# Altium project BE-PC_EXP_V100.PrjPcb (part 2 of 4)

## Sheet 08_MCU.SchDoc
size 420 x 297 mm; SheetNumber: 15; SheetTotal: 29
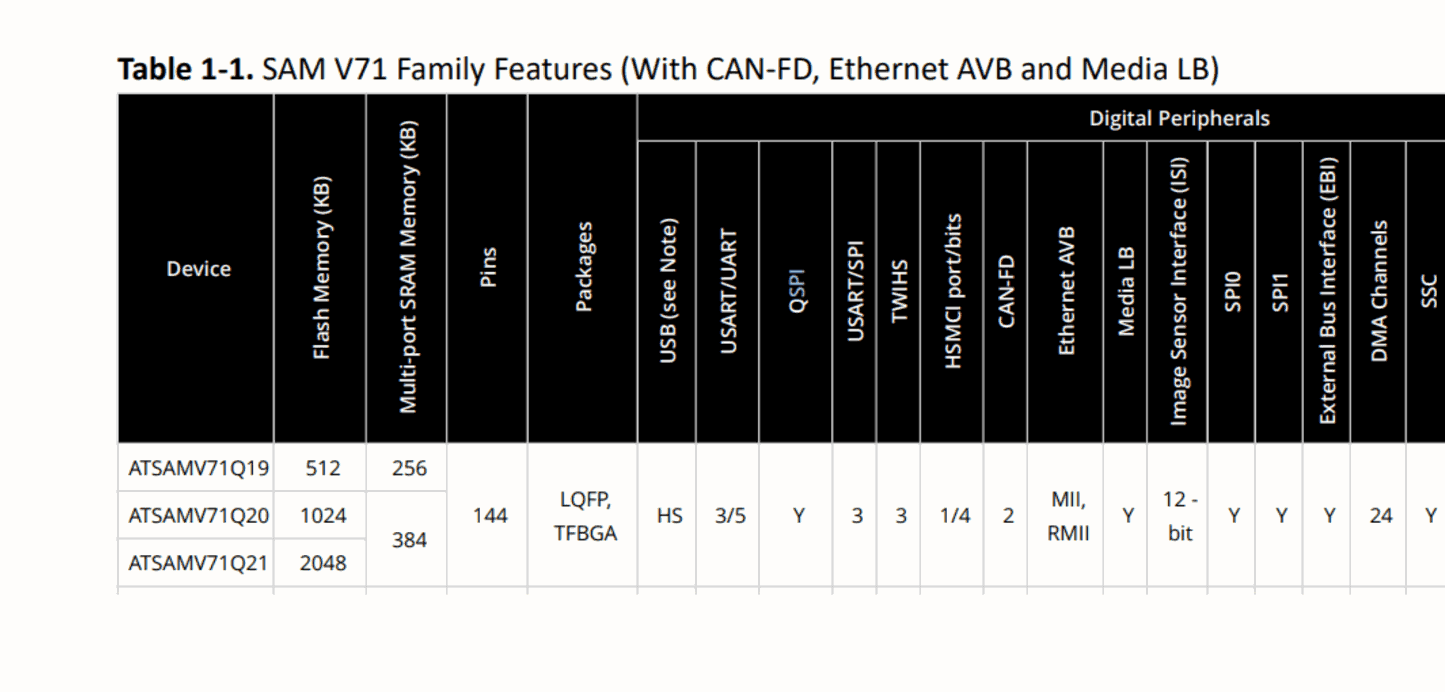
[diagram p13: 08_MCU.SchDoc, top left]
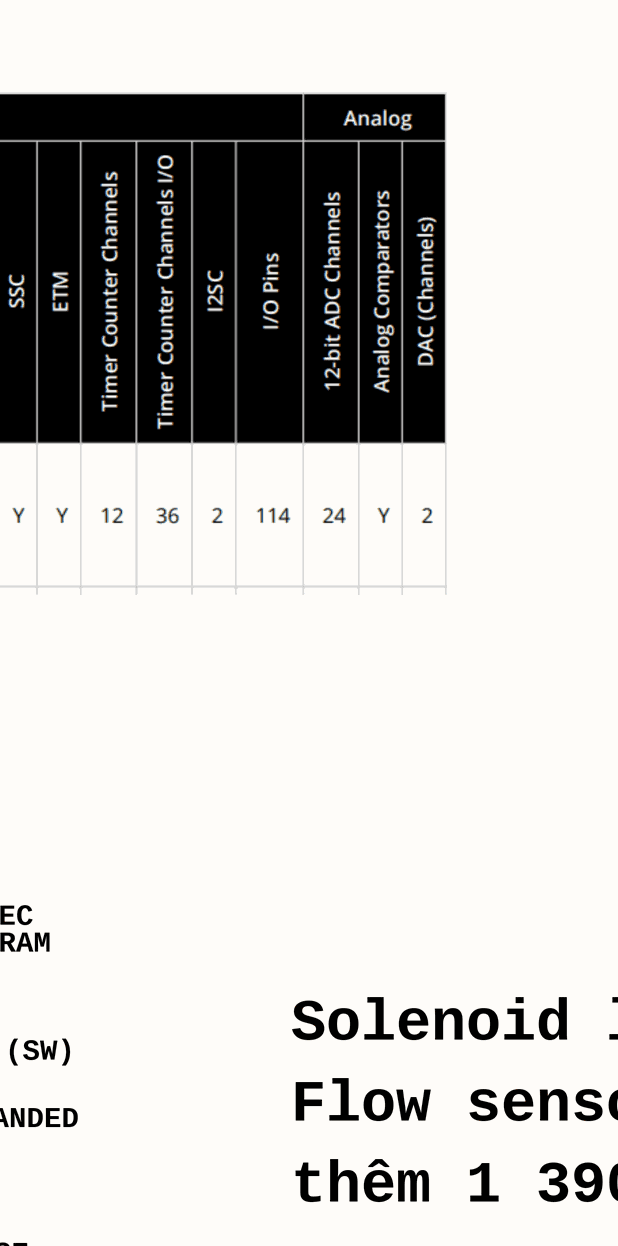
[diagram p14: 08_MCU.SchDoc, top right]
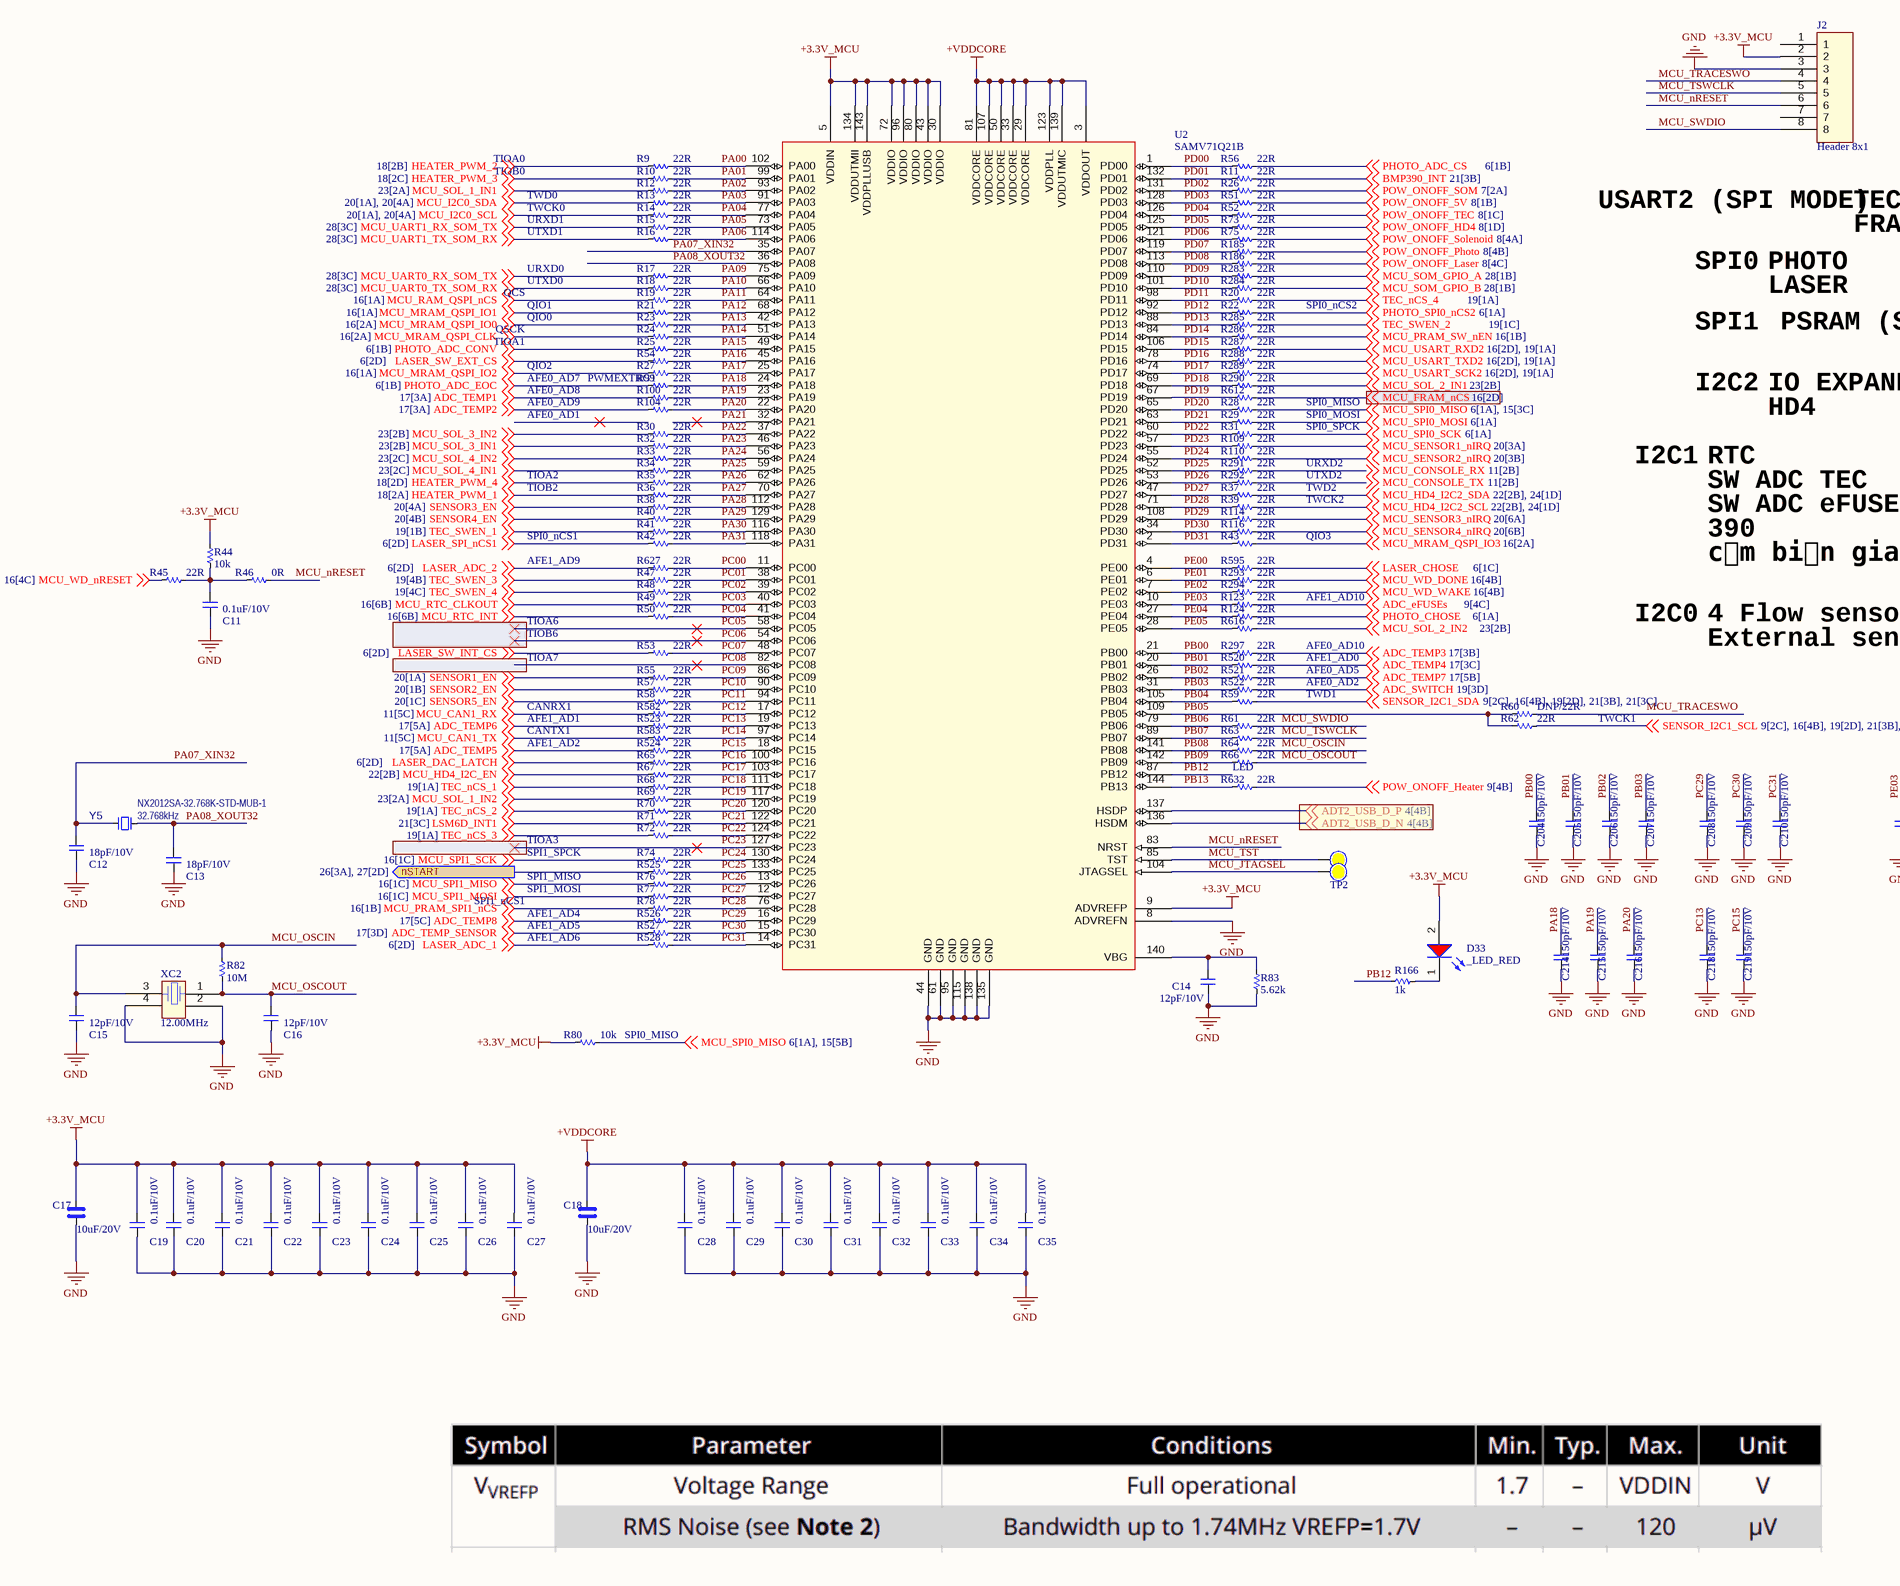
[diagram p15: 08_MCU.SchDoc, bottom left]
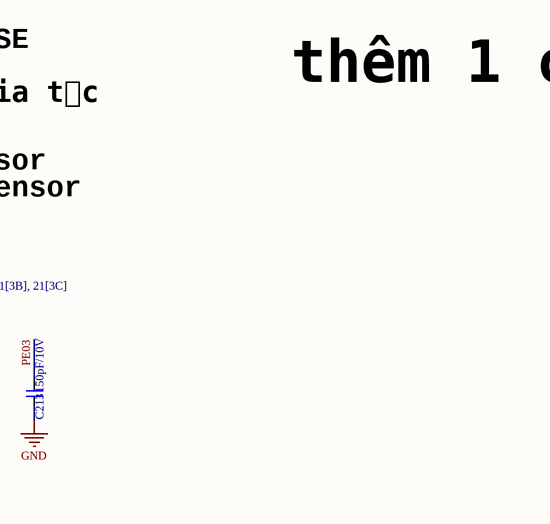
[diagram p16: 08_MCU.SchDoc, bottom right]

### Parts
C11  0.1uF/10V  [CAP_C_1005X60]
C12  18pF/10V  [CAP_C_1005X60]
C13  18pF/10V  [CAP_C_1005X60]
C14  12pF/10V  [CAP_C_1005X60]
C15  12pF/10V  [CAP_C_1005X60]
C16  12pF/10V  [CAP_C_1005X60]
C17  10uF/20V  [CAP_C_2012X110]
C18  10uF/20V  [CAP_C_2012X110]
C19  0.1uF/10V  [CAP_C_1005X60]
C20  0.1uF/10V  [CAP_C_1005X60]
C21  0.1uF/10V  [CAP_C_1005X60]
C22  0.1uF/10V  [CAP_C_1005X60]
C23  0.1uF/10V  [CAP_C_1005X60]
C24  0.1uF/10V  [CAP_C_1005X60]
C25  0.1uF/10V  [CAP_C_1005X60]
C26  0.1uF/10V  [CAP_C_1005X60]
C27  0.1uF/10V  [CAP_C_1005X60]
C28  0.1uF/10V  [CAP_C_1005X60]
C29  0.1uF/10V  [CAP_C_1005X60]
C30  0.1uF/10V  [CAP_C_1005X60]
C31  0.1uF/10V  [CAP_C_1005X60]
C32  0.1uF/10V  [CAP_C_1005X60]
C33  0.1uF/10V  [CAP_C_1005X60]
C34  0.1uF/10V  [CAP_C_1005X60]
C35  0.1uF/10V  [CAP_C_1005X60]
C204  150pF/10V  [CAP_C_1005X60]
C205  150pF/10V  [CAP_C_1005X60]
C206  150pF/10V  [CAP_C_1005X60]
C207  150pF/10V  [CAP_C_1005X60]
C208  150pF/10V  [CAP_C_1005X60]
C209  150pF/10V  [CAP_C_1005X60]
C210  150pF/10V  [CAP_C_1005X60]
C213  150pF/10V  [CAP_C_1005X60]
C214  150pF/10V  [CAP_C_1005X60]
C215  150pF/10V  [CAP_C_1005X60]
C216  150pF/10V  [CAP_C_1005X60]
C218  150pF/10V  [CAP_C_1005X60]
C219  150pF/10V  [CAP_C_1005X60]
D33  _LED_RED  [LED_0603]
J2  Header 8x1  [Header_254P_8x1]
R9  22R  [RES_C_1005X40]
R10  22R  [RES_C_1005X40]
R11  22R  [RES_C_1005X40]
R12  22R  [RES_C_1005X40]
R13  22R  [RES_C_1005X40]
R14  22R  [RES_C_1005X40]
R15  22R  [RES_C_1005X40]
R16  22R  [RES_C_1005X40]
R17  22R  [RES_C_1005X40]
R18  22R  [RES_C_1005X40]
R19  22R  [RES_C_1005X40]
R20  22R  [RES_C_1005X40]
R21  22R  [RES_C_1005X40]
R22  22R  [RES_C_1005X40]
R23  22R  [RES_C_1005X40]
R24  22R  [RES_C_1005X40]
R25  22R  [RES_C_1005X40]
R26  22R  [RES_C_1005X40]
R27  22R  [RES_C_1005X40]
R28  22R  [RES_C_1005X40]
R29  22R  [RES_C_1005X40]
R30  22R  [RES_C_1005X40]
R31  22R  [RES_C_1005X40]
R32  22R  [RES_C_1005X40]
R33  22R  [RES_C_1005X40]
R34  22R  [RES_C_1005X40]
R35  22R  [RES_C_1005X40]
R36  22R  [RES_C_1005X40]
R37  22R  [RES_C_1005X40]
R38  22R  [RES_C_1005X40]
R39  22R  [RES_C_1005X40]
R40  22R  [RES_C_1005X40]
R41  22R  [RES_C_1005X40]
R42  22R  [RES_C_1005X40]
R43  22R  [RES_C_1005X40]
R44  10k  [RES_C_1005X40]
R45  22R  [RES_C_1005X40]
R46  0R  [RES_C_1005X40]
R47  22R  [RES_C_1005X40]
R48  22R  [RES_C_1005X40]
R49  22R  [RES_C_1005X40]
R50  22R  [RES_C_1005X40]
R51  22R  [RES_C_1005X40]
R52  22R  [RES_C_1005X40]
R53  22R  [RES_C_1005X40]
R54  22R  [RES_C_1005X40]
R55  22R  [RES_C_1005X40]
R56  22R  [RES_C_1005X40]
R57  22R  [RES_C_1005X40]
R58  22R  [RES_C_1005X40]
R59  22R  [RES_C_1005X40]
R60  DNP/22R  [RES_C_1005X40]
R61  22R  [RES_C_1005X40]
R62  22R  [RES_C_1005X40]
R63  22R  [RES_C_1005X40]
R64  22R  [RES_C_1005X40]
R65  22R  [RES_C_1005X40]
R66  22R  [RES_C_1005X40]
R67  22R  [RES_C_1005X40]
R68  22R  [RES_C_1005X40]
R69  22R  [RES_C_1005X40]
R70  22R  [RES_C_1005X40]
R71  22R  [RES_C_1005X40]
R72  22R  [RES_C_1005X40]
R73  22R  [RES_C_1005X40]
R74  22R  [RES_C_1005X40]
R75  22R  [RES_C_1005X40]
R76  22R  [RES_C_1005X40]
R77  22R  [RES_C_1005X40]
R78  22R  [RES_C_1005X40]
R80  10k  [RES_C_1005X40]
R82  10M  [RES_C_1005X40]
R83  5.62k  [RES_C_1005X40]
R99  22R  [RES_C_1005X40]
R100  22R  [RES_C_1005X40]
R104  22R  [RES_C_1005X40]
R109  22R  [RES_C_1005X40]
R110  22R  [RES_C_1005X40]
R114  22R  [RES_C_1005X40]
R116  22R  [RES_C_1005X40]
R123  22R  [RES_C_1005X40]
R124  22R  [RES_C_1005X40]
R166  1k  [RES_C_1005X40]
R185  22R  [RES_C_1005X40]
R186  22R  [RES_C_1005X40]
R283  22R  [RES_C_1005X40]
R284  22R  [RES_C_1005X40]
R285  22R  [RES_C_1005X40]
R286  22R  [RES_C_1005X40]
R287  22R  [RES_C_1005X40]
R288  22R  [RES_C_1005X40]
R289  22R  [RES_C_1005X40]
R290  22R  [RES_C_1005X40]
R291  22R  [RES_C_1005X40]
R292  22R  [RES_C_1005X40]
R293  22R  [RES_C_1005X40]
R294  22R  [RES_C_1005X40]
R297  22R  [RES_C_1005X40]
R520  22R  [RES_C_1005X40]
R521  22R  [RES_C_1005X40]
R522  22R  [RES_C_1005X40]
R523  22R  [RES_C_1005X40]
R524  22R  [RES_C_1005X40]
R525  22R  [RES_C_1005X40]
R526  22R  [RES_C_1005X40]
R527  22R  [RES_C_1005X40]
R528  22R  [RES_C_1005X40]
R582  22R  [RES_C_1005X40]
R583  22R  [RES_C_1005X40]
R595  22R  [RES_C_1005X40]
R612  22R  [RES_C_1005X40]
R616  22R  [RES_C_1005X40]
R627  22R  [RES_C_1005X40]
R632  22R  [RES_C_1005X40]
TP1  (no value)  [Testpoint_TH_D130H80]  (no BOM)
TP2  (no value)  [Testpoint_TH_D130H80]  (no BOM)
U2  SAMV71Q21B  [AP6-00118]
XC2  value 12.00MHz  [AP7-00039]
Y5  value 32.768kHz  Manufacturer Part Number 1: NX2012SA-32.768K-STD-MUB-1  [CRYSTAL_NX2012SA]  (hidden comment: Crystal 2 Pins)

### Ports
nSTART (out, see 26[3A], 27[2D])

### Nets
+3.3V_MCU: C17.1 C19.2 C20.2 C21.2 C22.2 C23.2 C24.2 C25.2 C26.2 C27.2 D33.2(A) J2.2 R44.2 R80.2 U2.5(VDDIN) U2.9(ADVREFP) U2.30(VDDIO) U2.43(VDDIO) U2.72(VDDIO) U2.80(VDDIO) U2.96(VDDIO) U2.134(VDDUTMII) U2.143(VDDPLLUSB)
+VDDCORE: C18.1 C28.2 C29.2 C30.2 C31.2 C32.2 C33.2 C34.2 C35.2 U2.3(VDDOUT) U2.29(VDDCORE) U2.33(VDDCORE) U2.50(VDDCORE) U2.81(VDDCORE) U2.107(VDDCORE) U2.123(VDDPLL) U2.139(VDDUTMIC)
GND: C11.1 C12.1 C13.1 C14.1 C15.1 C16.1 C17.2 C18.2 C19.1 C20.1 C21.1 C22.1 C23.1 C24.1 C25.1 C26.1 C27.1 C28.1 C29.1 C30.1 C31.1 C32.1 C33.1 C34.1 C35.1 C204.1 C205.1 C206.1 C207.1 C208.1 C209.1 C210.1 C213.1 C214.1 C215.1 C216.1 C218.1 C219.1 J2.3 R83.1 U2.8(ADVREFN) U2.44(GND) U2.61(GND) U2.95(GND) U2.115(GND) U2.135(GND) U2.138(GND) XC2.2 XC2.4
ADC_eFUSEs: R123.1 ; off-sheet ADC_eFUSEs
ADC_SWITCH: R522.1 ; off-sheet ADC_SWITCH
ADC_TEMP1: R100.2 ; off-sheet ADC_TEMP1
ADC_TEMP2: R104.2 ; off-sheet ADC_TEMP2
ADC_TEMP3: R297.1 ; off-sheet ADC_TEMP3
ADC_TEMP4: R520.1 ; off-sheet ADC_TEMP4
ADC_TEMP5: R524.2 ; off-sheet ADC_TEMP5
ADC_TEMP6: R523.2 ; off-sheet ADC_TEMP6
ADC_TEMP7: R521.1 ; off-sheet ADC_TEMP7
ADC_TEMP8: R526.2 ; off-sheet ADC_TEMP8
ADC_TEMP_SENSOR: R527.2 ; off-sheet ADC_TEMP_SENSOR  [project net TEMP _SENSOR]
ADT2_USB_D_N: U2.136(HSDM) ; off-sheet ADT2_USB_D_N
ADT2_USB_D_P: U2.137(HSDP) ; off-sheet ADT2_USB_D_P
BMP390_INT: R11.1 ; off-sheet BMP390_INT
HEATER_PWM_1: R36.2 ; off-sheet HEATER_PWM_1
HEATER_PWM_2: R9.2 ; off-sheet HEATER_PWM_2
HEATER_PWM_3: R10.2 ; off-sheet HEATER_PWM_3
HEATER_PWM_4: R35.2 ; off-sheet HEATER_PWM_4
LASER_ADC_1: R528.2 ; off-sheet LASER_ADC_1
LASER_ADC_2: R627.2 ; off-sheet LASER_ADC_2
LASER_CHOSE: R595.1 ; off-sheet LASER_CHOSE
LASER_DAC_LATCH: R65.2 ; off-sheet LASER_DAC_LATCH
LASER_SPI_nCS1: R42.2 ; off-sheet LASER_SPI_nCS1
LASER_SW_EXT_CS: R54.2 ; off-sheet LASER_SW_EXT_CS
LASER_SW_INT_CS: R53.2 ; off-sheet LASER_SW_INT_CS
LSM6D_INT1: R71.2 ; off-sheet LSM6D_INT1
MCU_CAN1_RX: R582.2 ; off-sheet MCU_CAN1_RX
MCU_CAN1_TX: R583.2 ; off-sheet MCU_CAN1_TX
MCU_CONSOLE_RX: R291.1 ; off-sheet MCU_CONSOLE_RX
MCU_CONSOLE_TX: R292.1 ; off-sheet MCU_CONSOLE_TX
MCU_FRAM_nCS: R612.1 ; off-sheet MCU_FRAM_nCS
MCU_HD4_I2C2_SCL: R39.1 ; off-sheet MCU_HD4_I2C2_SCL
MCU_HD4_I2C2_SDA: R37.1 ; off-sheet MCU_HD4_I2C2_SDA
MCU_HD4_I2C_EN: R67.2 ; off-sheet MCU_HD4_I2C_EN
MCU_I2C0_SCL: R14.2 ; off-sheet MCU_I2C0_SCL
MCU_I2C0_SDA: R13.2 ; off-sheet MCU_I2C0_SDA
MCU_JTAGSEL: TP2.1 U2.104(JTAGSEL)
MCU_MRAM_QSPI_CLK: R24.2 ; off-sheet MCU_MRAM_QSPI_CLK
MCU_MRAM_QSPI_IO0: R23.2 ; off-sheet MCU_MRAM_QSPI_IO0
MCU_MRAM_QSPI_IO1: R21.2 ; off-sheet MCU_MRAM_QSPI_IO1
MCU_MRAM_QSPI_IO2: R27.2 ; off-sheet MCU_MRAM_QSPI_IO2
MCU_MRAM_QSPI_IO3: R43.1 ; off-sheet MCU_MRAM_QSPI_IO3
MCU_nRESET: J2.6 R46.1 U2.83(NRST)
MCU_OSCIN: C15.2 R64.1 R82.2 XC2.3
MCU_OSCOUT: C16.2 R66.1 R82.1 XC2.1
MCU_PRAM_SPI1_nCS: R78.2 ; off-sheet MCU_PRAM_SPI1_nCS
MCU_PRAM_SW_nEN: R286.1 ; off-sheet MCU_PRAM_SW_nEN
MCU_RAM_QSPI_nCS: R19.2 ; off-sheet MCU_RAM_QSPI_nCS
MCU_RTC_CLKOUT: R49.2 ; off-sheet MCU_RTC_CLKOUT
MCU_RTC_INT: R50.2 ; off-sheet MCU_RTC_INT
MCU_SENSOR1_nIRQ: R109.1 ; off-sheet MCU_SENSOR1_nIRQ
MCU_SENSOR2_nIRQ: R110.1 ; off-sheet MCU_SENSOR2_nIRQ
MCU_SENSOR3_nIRQ: R114.1 ; off-sheet MCU_SENSOR3_nIRQ
MCU_SENSOR4_nIRQ: R116.1 ; off-sheet MCU_SENSOR4_nIRQ
MCU_SOL_1_IN1: R12.2 ; off-sheet MCU_SOL_1_IN1
MCU_SOL_1_IN2: R69.2 ; off-sheet MCU_SOL_1_IN2
MCU_SOL_2_IN1: R290.1 ; off-sheet MCU_SOL_2_IN1
MCU_SOL_2_IN2: R616.1 ; off-sheet MCU_SOL_2_IN2
MCU_SOL_3_IN1: R32.2 ; off-sheet MCU_SOL_3_IN1
MCU_SOL_3_IN2: R30.2 ; off-sheet MCU_SOL_3_IN2
MCU_SOL_4_IN1: R34.2 ; off-sheet MCU_SOL_4_IN1
MCU_SOL_4_IN2: R33.2 ; off-sheet MCU_SOL_4_IN2
MCU_SOM_GPIO_A: R283.1 ; off-sheet MCU_SOM_GPIO_A
MCU_SOM_GPIO_B: R284.1 ; off-sheet MCU_SOM_GPIO_B
MCU_SPI0_MISO: R28.1 R80.1 ; off-sheet MCU_SPI0_MISO
MCU_SPI0_MOSI: R29.1 ; off-sheet MCU_SPI0_MOSI
MCU_SPI0_SCK: R31.1 ; off-sheet MCU_SPI0_SCK
MCU_SPI1_MISO: R76.2 ; off-sheet MCU_SPI1_MISO
MCU_SPI1_MOSI: R77.2 ; off-sheet MCU_SPI1_MOSI
MCU_SPI1_SCK: R74.2 ; off-sheet MCU_SPI1_SCK
MCU_SWDIO: J2.8 R61.1
MCU_TRACESWO: J2.4 R60.1
MCU_TST: TP1.1 U2.85(TST)
MCU_TSWCLK: J2.5 R63.1
MCU_UART0_RX_SOM_TX: R17.2 ; off-sheet MCU_UART0_RX_SOM_TX
MCU_UART0_TX_SOM_RX: R18.2 ; off-sheet MCU_UART0_TX_SOM_RX
MCU_UART1_RX_SOM_TX: R15.2 ; off-sheet MCU_UART1_RX_SOM_TX
MCU_UART1_TX_SOM_RX: R16.2 ; off-sheet MCU_UART1_TX_SOM_RX
MCU_USART_RXD2: R287.1 ; off-sheet MCU_USART_RXD2
MCU_USART_SCK2: R289.1 ; off-sheet MCU_USART_SCK2
MCU_USART_TXD2: R288.1 ; off-sheet MCU_USART_TXD2
MCU_WD_DONE: R293.1 ; off-sheet MCU_WD_DONE  [project net WD_DONE]
MCU_WD_nRESET: R45.2 ; off-sheet MCU_WD_nRESET  [project net WD_nRESET]
MCU_WD_WAKE: R294.1 ; off-sheet MCU_WD_WAKE  [project net WD_WAKE]
PA00: R9.1 U2.102(PA00)
PA01: R10.1 U2.99(PA01)
PA02: R12.1 U2.93(PA02)
PA03: R13.1 U2.91(PA03)
PA04: R14.1 U2.77(PA04)
PA05: R15.1 U2.73(PA05)
PA06: R16.1 U2.114(PA06)
PA07_XIN32: C12.2 U2.35(PA07) Y5.2(Osc2)
PA08_XOUT32: C13.2 U2.36(PA08) Y5.1(Osc1)
PA09: R17.1 U2.75(PA09)
PA10: R18.1 U2.66(PA10)
PA11: R19.1 U2.64(PA11)
PA12: R21.1 U2.68(PA12)
PA13: R23.1 U2.42(PA13)
PA14: R24.1 U2.51(PA14)
PA15: R25.1 U2.49(PA15)
PA16: R54.1 U2.45(PA16)
PA17: R27.1 U2.25(PA17)
PA18: C214.2 R99.1 U2.24(PA18)
PA19: C215.2 R100.1 U2.23(PA19)
PA20: C216.2 R104.1 U2.22(PA20)
PA21: U2.32(PA21)
PA22: R30.1 U2.37(PA22)
PA23: R32.1 U2.46(PA23)
PA24: R33.1 U2.56(PA24)
PA25: R34.1 U2.59(PA25)
PA26: R35.1 U2.62(PA26)
PA27: R36.1 U2.70(PA27)
PA28: R38.1 U2.112(PA28)
PA29: R40.1 U2.129(PA29)
PA30: R41.1 U2.116(PA30)
PA31: R42.1 U2.118(PA31)
PB00: C204.2 R297.2 U2.21(PB00)
PB01: C205.2 R520.2 U2.20(PB01)
PB02: C206.2 R521.2 U2.26(PB02)
PB03: C207.2 R522.2 U2.31(PB03)
PB04: R59.2 U2.105(PB04)
PB05: R60.2 R62.2 U2.109(PB05)
PB06: R61.2 U2.79(PB06)
PB07: R63.2 U2.89(PB07)
PB08: R64.2 U2.141(PB08)
PB09: R66.2 U2.142(PB09)
PB12: R166.1 U2.87(PB12)
PB13: R632.2 U2.144(PB13)
PC00: R627.1 U2.11(PC00)
PC01: R47.1 U2.38(PC01)
PC02: R48.1 U2.39(PC02)
PC03: R49.1 U2.40(PC03)
PC04: R50.1 U2.41(PC04)
PC05: U2.58(PC05)
PC06: U2.54(PC06)
PC07: R53.1 U2.48(PC07)
PC08: U2.82(PC08)
PC09: R55.1 U2.86(PC09)
PC10: R57.1 U2.90(PC10)
PC11: R58.1 U2.94(PC11)
PC12: R582.1 U2.17(PC12)
PC13: C218.2 R523.1 U2.19(PC13)
PC14: R583.1 U2.97(PC14)
PC15: C219.2 R524.1 U2.18(PC15)
PC16: R65.1 U2.100(PC16)
PC17: R67.1 U2.103(PC17)
PC18: R68.1 U2.111(PC18)
PC19: R69.1 U2.117(PC19)
PC20: R70.1 U2.120(PC20)
PC21: R71.1 U2.122(PC21)
PC22: R72.1 U2.124(PC22)
PC23: U2.127(PC23)
PC24: R74.1 U2.130(PC24)
PC25: R525.1 U2.133(PC25)
PC26: R76.1 U2.13(PC26)
PC27: R77.1 U2.12(PC27)
PC28: R78.1 U2.76(PC28)
PC29: C208.2 R526.1 U2.16(PC29)
PC30: C209.2 R527.1 U2.15(PC30)
PC31: C210.2 R528.1 U2.14(PC31)
PD00: R56.2 U2.1(PD00)
PD01: R11.2 U2.132(PD01)
PD02: R26.2 U2.131(PD02)
PD03: R51.2 U2.128(PD03)
PD04: R52.2 U2.126(PD04)
PD05: R73.2 U2.125(PD05)
PD06: R75.2 U2.121(PD06)
PD07: R185.2 U2.119(PD07)
PD08: R186.2 U2.113(PD08)
PD09: R283.2 U2.110(PD09)
PD10: R284.2 U2.101(PD10)
PD11: R20.2 U2.98(PD11)
PD12: R22.2 U2.92(PD12)
PD13: R285.2 U2.88(PD13)
PD14: R286.2 U2.84(PD14)
PD15: R287.2 U2.106(PD15)
PD16: R288.2 U2.78(PD16)
PD17: R289.2 U2.74(PD17)
PD18: R290.2 U2.69(PD18)
PD19: R612.2 U2.67(PD19)
PD20: R28.2 U2.65(PD20)
PD21: R29.2 U2.63(PD21)
PD22: R31.2 U2.60(PD22)
PD23: R109.2 U2.57(PD23)
PD24: R110.2 U2.55(PD24)
PD25: R291.2 U2.52(PD25)
PD26: R292.2 U2.53(PD26)
PD27: R37.2 U2.47(PD27)
PD28: R39.2 U2.71(PD28)
PD29: R114.2 U2.108(PD29)
PD30: R116.2 U2.34(PD30)
PD31: R43.2 U2.2(PD31)
PE00: R595.2 U2.4(PE00)
PE01: R293.2 U2.6(PE01)
PE02: R294.2 U2.7(PE02)
PE03: C213.2 R123.2 U2.10(PE03)
PE04: R124.2 U2.27(PE04)
PE05: R616.2 U2.28(PE05)
PHOTO_ADC_CONV: R25.2 ; off-sheet PHOTO_ADC_CONV
PHOTO_ADC_CS: R56.1 ; off-sheet PHOTO_ADC_CS
PHOTO_ADC_EOC: R99.2 ; off-sheet PHOTO_ADC_EOC
PHOTO_CHOSE: R124.1 ; off-sheet PHOTO_CHOSE
PHOTO_SPI0_nCS2: R22.1 ; off-sheet PHOTO_SPI0_nCS2
POW_ONOFF_5V: R51.1 ; off-sheet POW_ONOFF_5V
POW_ONOFF_HD4: R73.1 ; off-sheet POW_ONOFF_HD4
POW_ONOFF_Heater: R632.1 ; off-sheet POW_ONOFF_Heater
POW_ONOFF_Laser: R186.1 ; off-sheet POW_ONOFF_Laser
POW_ONOFF_Photo: R185.1 ; off-sheet POW_ONOFF_Photo
POW_ONOFF_Solenoid: R75.1 ; off-sheet POW_ONOFF_Solenoid
POW_ONOFF_SOM: R26.1 ; off-sheet POW_ONOFF_SOM
POW_ONOFF_TEC: R52.1 ; off-sheet POW_ONOFF_TEC
SENSOR1_EN: R55.2 ; off-sheet SENSOR1_EN
SENSOR2_EN: R57.2 ; off-sheet SENSOR2_EN
SENSOR3_EN: R38.2 ; off-sheet SENSOR3_EN
SENSOR4_EN: R40.2 ; off-sheet SENSOR4_EN
SENSOR5_EN: R58.2 ; off-sheet SENSOR5_EN
SENSOR_I2C1_SCL: R62.1 ; off-sheet SENSOR_I2C1_SCL
SENSOR_I2C1_SDA: R59.1 ; off-sheet SENSOR_I2C1_SDA
TEC_nCS_1: R68.2 ; off-sheet TEC_nCS_1
TEC_nCS_2: R70.2 ; off-sheet TEC_nCS_2
TEC_nCS_3: R72.2 ; off-sheet TEC_nCS_3
TEC_nCS_4: R20.1 ; off-sheet TEC_nCS_4
TEC_SWEN_1: R41.2 ; off-sheet TEC_SWEN_1
TEC_SWEN_2: R285.1 ; off-sheet TEC_SWEN_2
TEC_SWEN_3: R47.2 ; off-sheet TEC_SWEN_3
TEC_SWEN_4: R48.2 ; off-sheet TEC_SWEN_4
NetC11_2: C11.2 R44.1 R45.1 R46.2
NetC14_2: C14.2 R83.2 U2.140(VBG)
NetC288_1: R525.2 ; port nSTART
NetD33_1: D33.1(K) R166.2

Not connected (* = marked no-connect by the designer): J2 1 7

### Notes on the sheet
- TWD0
- TWCK0
- TIOA0
- TIOB0
- USART2 (SPI MODE)
- TEC
- URXD1
- UTXD1
- URXD0
- SPI0
- PHOTO
- FRAM
- UTXD0
- QIO1
- QCS
- QSCK
- QIO0
- SPI0_nCS2
- SPI1
- LASER
- PSRAM (SW)
- Solenoid lên 16 cái
- QIO2
- AFE0_AD8
- AFE0_AD7
- TIOA1
- PWMEXTRG1
- I2C2
- IO EXPANDED
- Flow sensor thêm 2 cái
- AFE0_AD1
- AFE0_AD9
- SPI0_MISO
- SPI0_MOSI
- SPI0_SPCK
- HD4
- TIOA2
- TIOB2
- TWD2
- TWCK2
- URXD2
- UTXD2
- I2C1
- RTC
- SW ADC TEC
- SW ADC eFUSE
- thêm 1 390 onboard
- SPI0_nCS1
- AFE1_AD9
- QIO3
- 390
- cảm biến gia tốc
- thêm 1 con cbien gia tốc
- TIOA6
- TIOB6
- AFE1_AD10
- I2C0
- 4 Flow sensor
- TIOA7
- AFE0_AD2
- AFE0_AD10
- AFE0_AD5
- AFE1_AD0
- TWD1
- External sensor
- AFE1_AD2
- AFE1_AD1
- CANRX1
- CANTX1
- TWCK1
- (near R66) LED
- SPI1_MISO
- SPI1_SPCK
- TIOA3
- SPI1_nCS1
- SPI1_MOSI
- AFE1_AD4
- AFE1_AD5
- AFE1_AD6
- (near R80) SPI0_MISO
- Project:
- Sub-system:
- Design by:
- Sheet title:
- Sheet
- of
- Checked by:
- Approved by:
- Revision:
- Document No:
- Size:
- Date:
- A3

### Library data of the parts
C11-C16 C19-C35 C204-C210 C213-C216 C218 C219 = _CAP_C_2: CAP CHIP
C17 C18 = _CAP_C_High_2: CAP CHIP High Value
R9-R78 R80 R82 R83 R99 R100 R104 R109 R110 R114 R116 R123 R124 R166 R185 R186 R283-R294 R297 R520-R528 R582 R583 R595 R612 R616 R627 R632 = _RES_B_2: RES
TP1 TP2 = Test Point: Solder: NF
U2 = A06-1541: SAM 32-bit ARM Cortex-M* RISC MCU, SAMV71B Series, QFP144; PartGroup: Integrated Circuits,MCU, MPU, DSP,ARM MCU; Manufacturer: MICROCHIP; MPN: ATSAMV71Q21B-AAB; TemperatureRange: -40Â°C to +105Â°C; AN: A06-1541; Value: SAMV71Q21B; Height: 1,60000002384186
XC2 = A07-0042: Fox FQ5032B 12.0MHz SMD crystal 738B-12; PartGroup: Frequency devices,Crystals,SMD; Manufacturer: Fox  Electronics; MPN: FQ5032B-12.000; Tolerance: Â±30ppm; TemperatureRange: 0Â°C ~ 70Â°C; AN: A07-0042; Height: 1,20000004768372
Y5 = OSC1092: Crystal; Manufacturer 1: NDK; Description_: CRYSTAL 32.768kHz 12.5pF SMD NX2012SA; Dev Tools Status: Production; Owner: Jamus Griego; Tolerance: ±20ppm; Load Capacitance: 12.5pF; Populated: YES; MCHP-ID: OSC1092; Revision: 1; Symbol: Crystal 2 Pins; Status: MCL Design; ComponentLink1URL: https://chn-vm-apps.microchip.com/mchprepo/parts/Datasheets/c_NX2012SA-STD-MUB-1_e.pdf; ComponentLink1Description: SVN Datasheet; ComponentLink2URL: C:\ALTIUM_WORK\00001_MCHP-CDB\Datasheets\c_NX2012SA-STD-MUB-1_e.pdf; ComponentLink2Description: Local Datasheet; ComponentLink3URL: C:\ALTIUM_WORK\00001_MCHP-CDB\Library\LibraryRefs\Crystal 2 Pins.SchLib; ComponentLink3Description: Open Symbol; ComponentLink4URL: C:\ALTIUM_WORK\00001_MCHP-CDB\Library\Footprints\CRYSTAL_NX2012SA.PcbLib; ComponentLink4Description: Open Footprint; ComponentLink5Description: Open Footprint 2; ComponentLink6Description: Open Footprint 3; ComponentLink7Description: Open Footprint 4; Type: Crystal; Category: Crystal/Oscillator; Supplier 1: Digi-Key; Supplier Part Number 1: 644-1219-1-ND; Quantity Override: 1

## Sheet 09_MRAM_RTC_WDT.SchDoc
size 420 x 297 mm; SheetNumber: 16; SheetTotal: 29
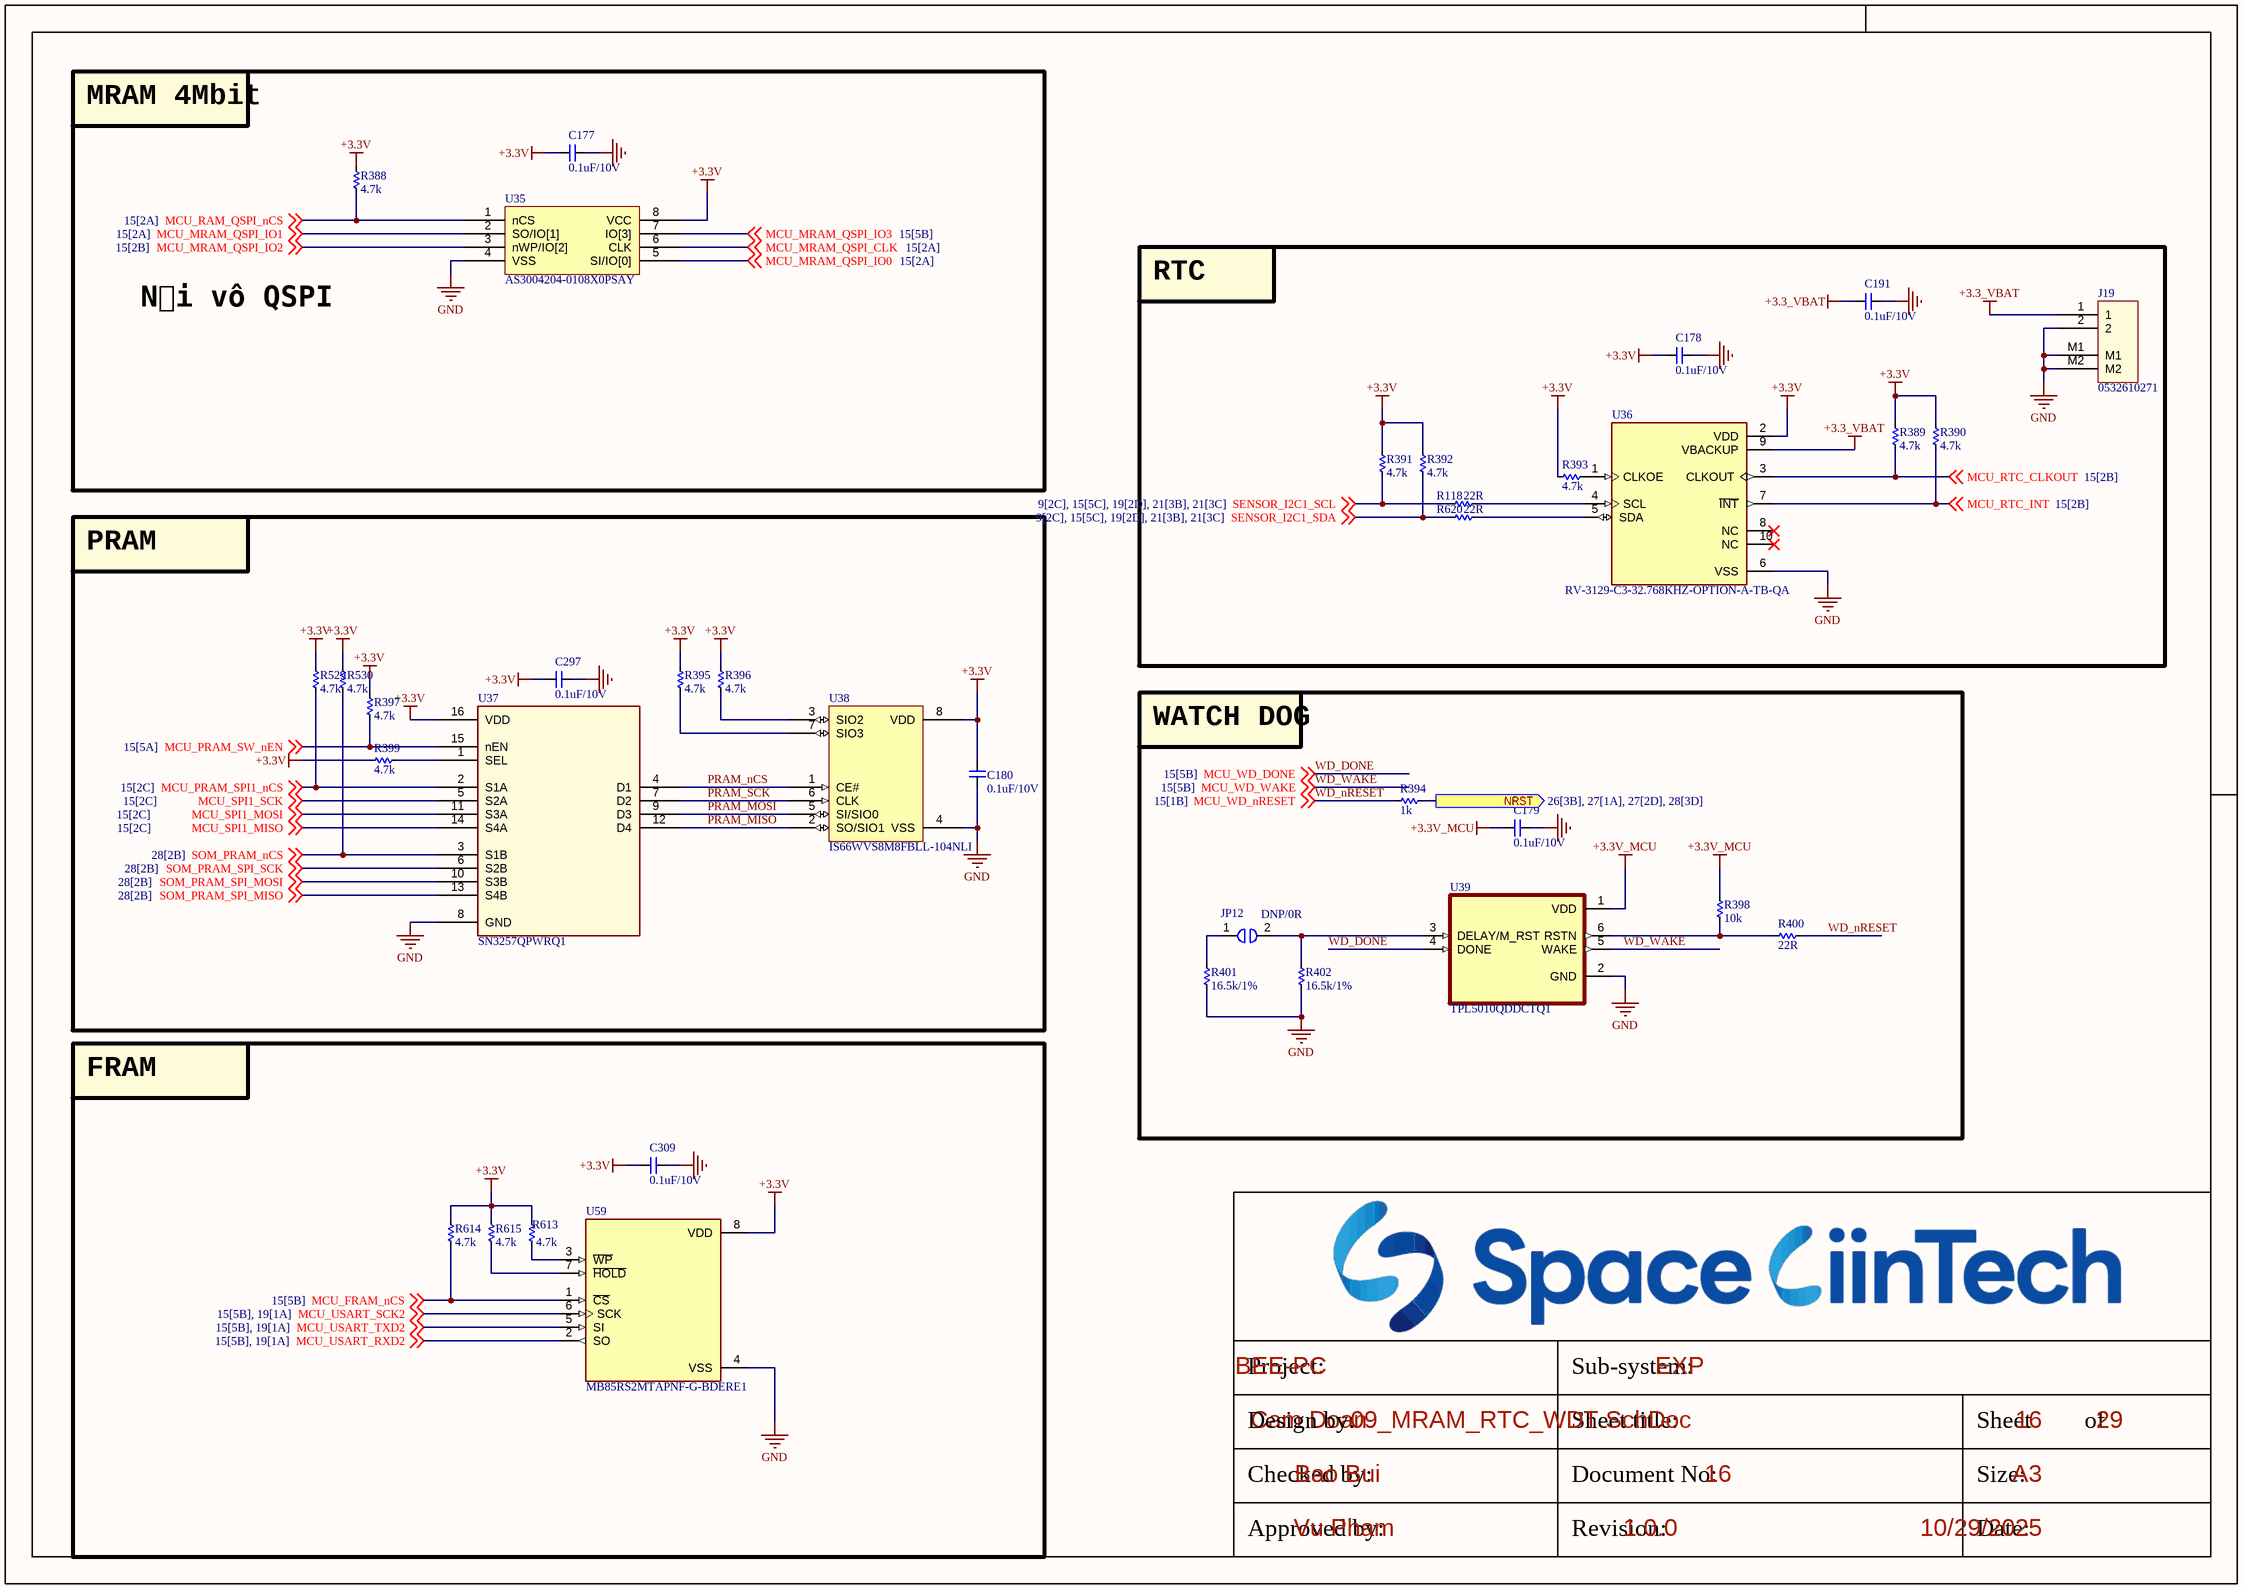
[diagram p17: 09_MRAM_RTC_WDT.SchDoc]

### Parts
C177  0.1uF/10V  [CAP_C_1005X60]
C178  0.1uF/10V  [CAP_C_1005X60]
C179  0.1uF/10V  [CAP_C_1005X60]
C180  0.1uF/10V  [CAP_C_1005X60]
C191  0.1uF/10V  [CAP_C_1005X60]
C297  0.1uF/10V  [CAP_C_1005X60]
C309  0.1uF/10V  [CAP_C_1005X60]
J19  0532610271  [MOLEX_0532610271]
JP12  DNP/0R  [RES_C_1608X60]
R118  22R  [RES_C_1005X40]
R388  4.7k  [RES_C_1005X40]
R389  4.7k  [RES_C_1005X40]
R390  4.7k  [RES_C_1005X40]
R391  4.7k  [RES_C_1005X40]
R392  4.7k  [RES_C_1005X40]
R393  4.7k  [RES_C_1005X40]
R394  1k  [RES_C_1005X40]
R395  4.7k  [RES_C_1005X40]
R396  4.7k  [RES_C_1005X40]
R397  4.7k  [RES_C_1005X40]
R398  10k  [RES_C_1005X40]
R399  4.7k  [RES_C_1005X40]
R400  22R  [RES_C_1005X40]
R401  16.5k/1%  [RES_C_1005X40]
R402  16.5k/1%  [RES_C_1005X40]
R529  4.7k  [RES_C_1005X40]
R530  4.7k  [RES_C_1005X40]
R613  4.7k  [RES_C_1005X40]
R614  4.7k  [RES_C_1005X40]
R615  4.7k  [RES_C_1005X40]
R620  22R  [RES_C_1005X40]
U35  AS3004204-0108X0PSAY  [SOIC127P790X216-8]
U36  RV-3129-C3-32.768KHZ-OPTION-A-TB-QA  [IC_RV-3129-C3_32.768KHZ_OPTION_A_TB_QA]
U37  SN3257QPWRQ1  [SOIC_PRQ1_TEX]
U38  IS66WVS8M8FBLL-104NLI  [SOIC8_150MIL_N_ISI]
U39  TPL5010QDDCTQ1  [SOT95P280X145-6N]
U59  MB85RS2MTAPNF-G-BDERE1  [SOIC127P602X173-8N]

### Blocks framed on the sheet
RTC: C178 C191 J19 R118 R389-R393 R620 U36
PRAM: C180 C297 R395-R397 R399 R529 R530 U37 U38
WATCH DOG: C179 JP12 R394 R398 R400-R402 U39
FRAM: C309 R613-R615 U59

### Ports
NRST (out, see 26[3B], 27[1A], 27[2D], 28[3D])

### Nets
+3.3_VBAT: C191.2 J19.1 U36.9(VBACKUP)
+3.3V: C177.2 C178.2 C180.1 C297.2 C309.2 R388.2 R389.2 R390.2 R391.2 R392.2 R393.2 R395.2 R396.2 R397.2 R399.2 R529.2 R530.2 R613.2 R614.2 R615.2 U35.8(VCC) U36.2(VDD) U37.16(VDD) U38.8(VDD) U59.8(VDD)
+3.3V_MCU: C179.2 R398.2 U39.1(VDD)
GND: C177.1 C178.1 C179.1 C180.2 C191.1 C297.1 C309.1 J19.2 J19.M1 J19.M2 R401.1 R402.1 U35.4(VSS) U36.6(VSS) U37.8(GND) U38.4(VSS) U39.2(GND) U59.4(VSS)
MCU_FRAM_nCS: R614.1 U59.1(~{CS}) ; off-sheet MCU_FRAM_nCS
MCU_MRAM_QSPI_CLK: U35.6(CLK) ; off-sheet MCU_MRAM_QSPI_CLK
MCU_MRAM_QSPI_IO0: U35.5(SI/IO[0]) ; off-sheet MCU_MRAM_QSPI_IO0
MCU_MRAM_QSPI_IO1: U35.2(SO/IO[1]) ; off-sheet MCU_MRAM_QSPI_IO1
MCU_MRAM_QSPI_IO2: U35.3(nWP/IO[2]) ; off-sheet MCU_MRAM_QSPI_IO2
MCU_MRAM_QSPI_IO3: U35.7(IO[3]) ; off-sheet MCU_MRAM_QSPI_IO3
MCU_PRAM_SPI1_nCS: R529.1 U37.2(S1A) ; off-sheet MCU_PRAM_SPI1_nCS
MCU_PRAM_SW_nEN: R397.1 U37.15(nEN) ; off-sheet MCU_PRAM_SW_nEN
MCU_RAM_QSPI_nCS: R388.1 U35.1(nCS) ; off-sheet MCU_RAM_QSPI_nCS
MCU_RTC_CLKOUT: R389.1 U36.3(CLKOUT) ; off-sheet MCU_RTC_CLKOUT
MCU_RTC_INT: R390.1 U36.7(~{INT}) ; off-sheet MCU_RTC_INT
MCU_SPI1_MISO: U37.14(S4A) ; off-sheet MCU_SPI1_MISO
MCU_SPI1_MOSI: U37.11(S3A) ; off-sheet MCU_SPI1_MOSI
MCU_SPI1_SCK: U37.5(S2A) ; off-sheet MCU_SPI1_SCK
MCU_USART_RXD2: U59.2(SO) ; off-sheet MCU_USART_RXD2
MCU_USART_SCK2: U59.6(SCK) ; off-sheet MCU_USART_SCK2
MCU_USART_TXD2: U59.5(SI) ; off-sheet MCU_USART_TXD2
PRAM_MISO: U37.12(D4) U38.2(SO/SIO1)
PRAM_MOSI: U37.9(D3) U38.5(SI/SIO0)
PRAM_nCS: U37.4(D1) U38.1(CE#)
PRAM_SCK: U37.7(D2) U38.6(CLK)
SENSOR_I2C1_SCL: R118.1 R391.1 ; off-sheet SENSOR_I2C1_SCL
SENSOR_I2C1_SDA: R392.1 R620.1 ; off-sheet SENSOR_I2C1_SDA
SOM_PRAM_nCS: R530.1 U37.3(S1B) ; off-sheet SOM_PRAM_nCS
SOM_PRAM_SPI_MISO: U37.13(S4B) ; off-sheet SOM_PRAM_SPI_MISO
SOM_PRAM_SPI_MOSI: U37.10(S3B) ; off-sheet SOM_PRAM_SPI_MOSI
SOM_PRAM_SPI_SCK: U37.6(S2B) ; off-sheet SOM_PRAM_SPI_SCK
WD_DONE: U39.4(DONE) ; off-sheet MCU_WD_DONE  [also labelled MCU_WD_DONE]
WD_nRESET: R394.2 R400.1 ; off-sheet MCU_WD_nRESET  [also labelled MCU_WD_nRESET]
WD_WAKE: U39.5(WAKE) ; off-sheet MCU_WD_WAKE  [also labelled MCU_WD_WAKE]
NetC290_2: R394.1 ; port NRST
NetJP12_1: JP12.1 R401.2
NetJP12_2: JP12.2 R402.2 U39.3(DELAY/M_RST)
NetR118_2: R118.2 U36.4(SCL)
NetR393_1: R393.1 U36.1(CLKOE)
NetR395_1: R395.1 U38.7(SIO3)
NetR396_1: R396.1 U38.3(SIO2)
NetR398_1: R398.1 R400.2 U39.6(RSTN)
NetR399_1: R399.1 U37.1(SEL)
NetR613_1: R613.1 U59.3(~{WP})
NetR615_1: R615.1 U59.7(~{HOLD})
NetR620_2: R620.2 U36.5(SDA)

Not connected (* = marked no-connect by the designer): U36 8(NC)* 10(NC)*

### Notes on the sheet
- MRAM 4Mbit
- Nối vô QSPI
- Project:
- Sub-system:
- Design by:
- Sheet title:
- Sheet
- of
- Checked by:
- Approved by:
- Revision:
- Document No:
- Size:
- Date:
- A3

### Library data of the parts
C177-C180 C191 C297 C309 = _CAP_C_2: CAP CHIP
J19 = Header 2x1_2M
JP12 = JUMPER_1_1
R118 R388-R402 R529 R530 R613-R615 R620 = _RES_B_2: RES
U35 = IC_RAM_AS3004204-0108X0PSAY
U36 = RV-3129-C3_32.768KHZ_OPTION_A_TB_QA: Real-Time Clock Module, Temperature compensated, in 2.5 x 3.7 mm package; MF: Micro Crystal; MP: RV-3129-C3 32.768KHZ OPTION A TB QA; SnapEDA_Link: https://www.snapeda.com/parts/RV-3129-C3%2032.768KHZ%20OPTION%20A%20TB%20QA/Micro+Crystal/view-part/?ref=snap; Package: QFN-10 Micro Crystal; Value: *; Check_prices: https://www.snapeda.com/parts/RV-3129-C3%2032.768KHZ%20OPTION%20A%20TB%20QA/Micro+Crystal/view-part/?ref=eda
U37 = IC_SW_SPI_SN3257QPWRQ1: Automotive 5-V, 2:1 (SPDT), 4-channel switch with 1.8-V logic and powered-off protection 16-TSSOP -40 to 125; Manufacturer_Name: Texas Instruments; Copyright: Copyright (C) 2025 Ultra Librarian. All rights reserved.; Manufacturer_Part_Number: SN3257QPWRQ1; Datasheet: https://www.ti.com/lit/gpn/sn3257-q1; RefDes: RefDes; Type: Type
U38 = IS66WVS4M8BLL-104NLI: No Description Available; Manufacturer_Name: ISSI; Type: Memory; Copyright: Copyright (C) 2025 Ultra Librarian. All rights reserved.; Manufacturer_Part_Number: IS66WVS4M8BLL-104NLI; RefDes: RefDes
U59 = MB85RS2MTAPNF-G-BDERE1: FRAM _Ferroelectric RAM_ Memory IC 2Mb _256K x 8_ SPI 40MHz 8-SOP; MF: Fujitsu Electronics; Package: SO-8 Fujitsu; Value: *; Digi-Key_Purchase_URL: https://www.digikey.com/product-detail/en/fujitsu-electronics-america-inc/MB85RS2MTAPNF-G-BDERE1/865-1286-1-ND/7916252?utm_source=snapeda&utm_medium=aggregator&utm_campaign=symbol; Digi-Key_Part_Number: 865-1286-1-ND; SnapEDA_Link: https://www.snapeda.com/parts/MB85RS2MTAPNF-G-BDERE1/Fujitsu%20Electronics%20America%2C%20Inc./view-part/2344795/?ref=snap; MP: MB85RS2MTAPNF-G-BDERE1
U39 = TPL5010QDDCTQ1: Package: None; Price: None; Value: *; MP: TPL5010QDDCTQ1; Availability: Unavailable

## Sheet 10_NTC_TEMPSENSOR.SchDoc
size 420 x 297 mm; SheetNumber: 17; SheetTotal: 28
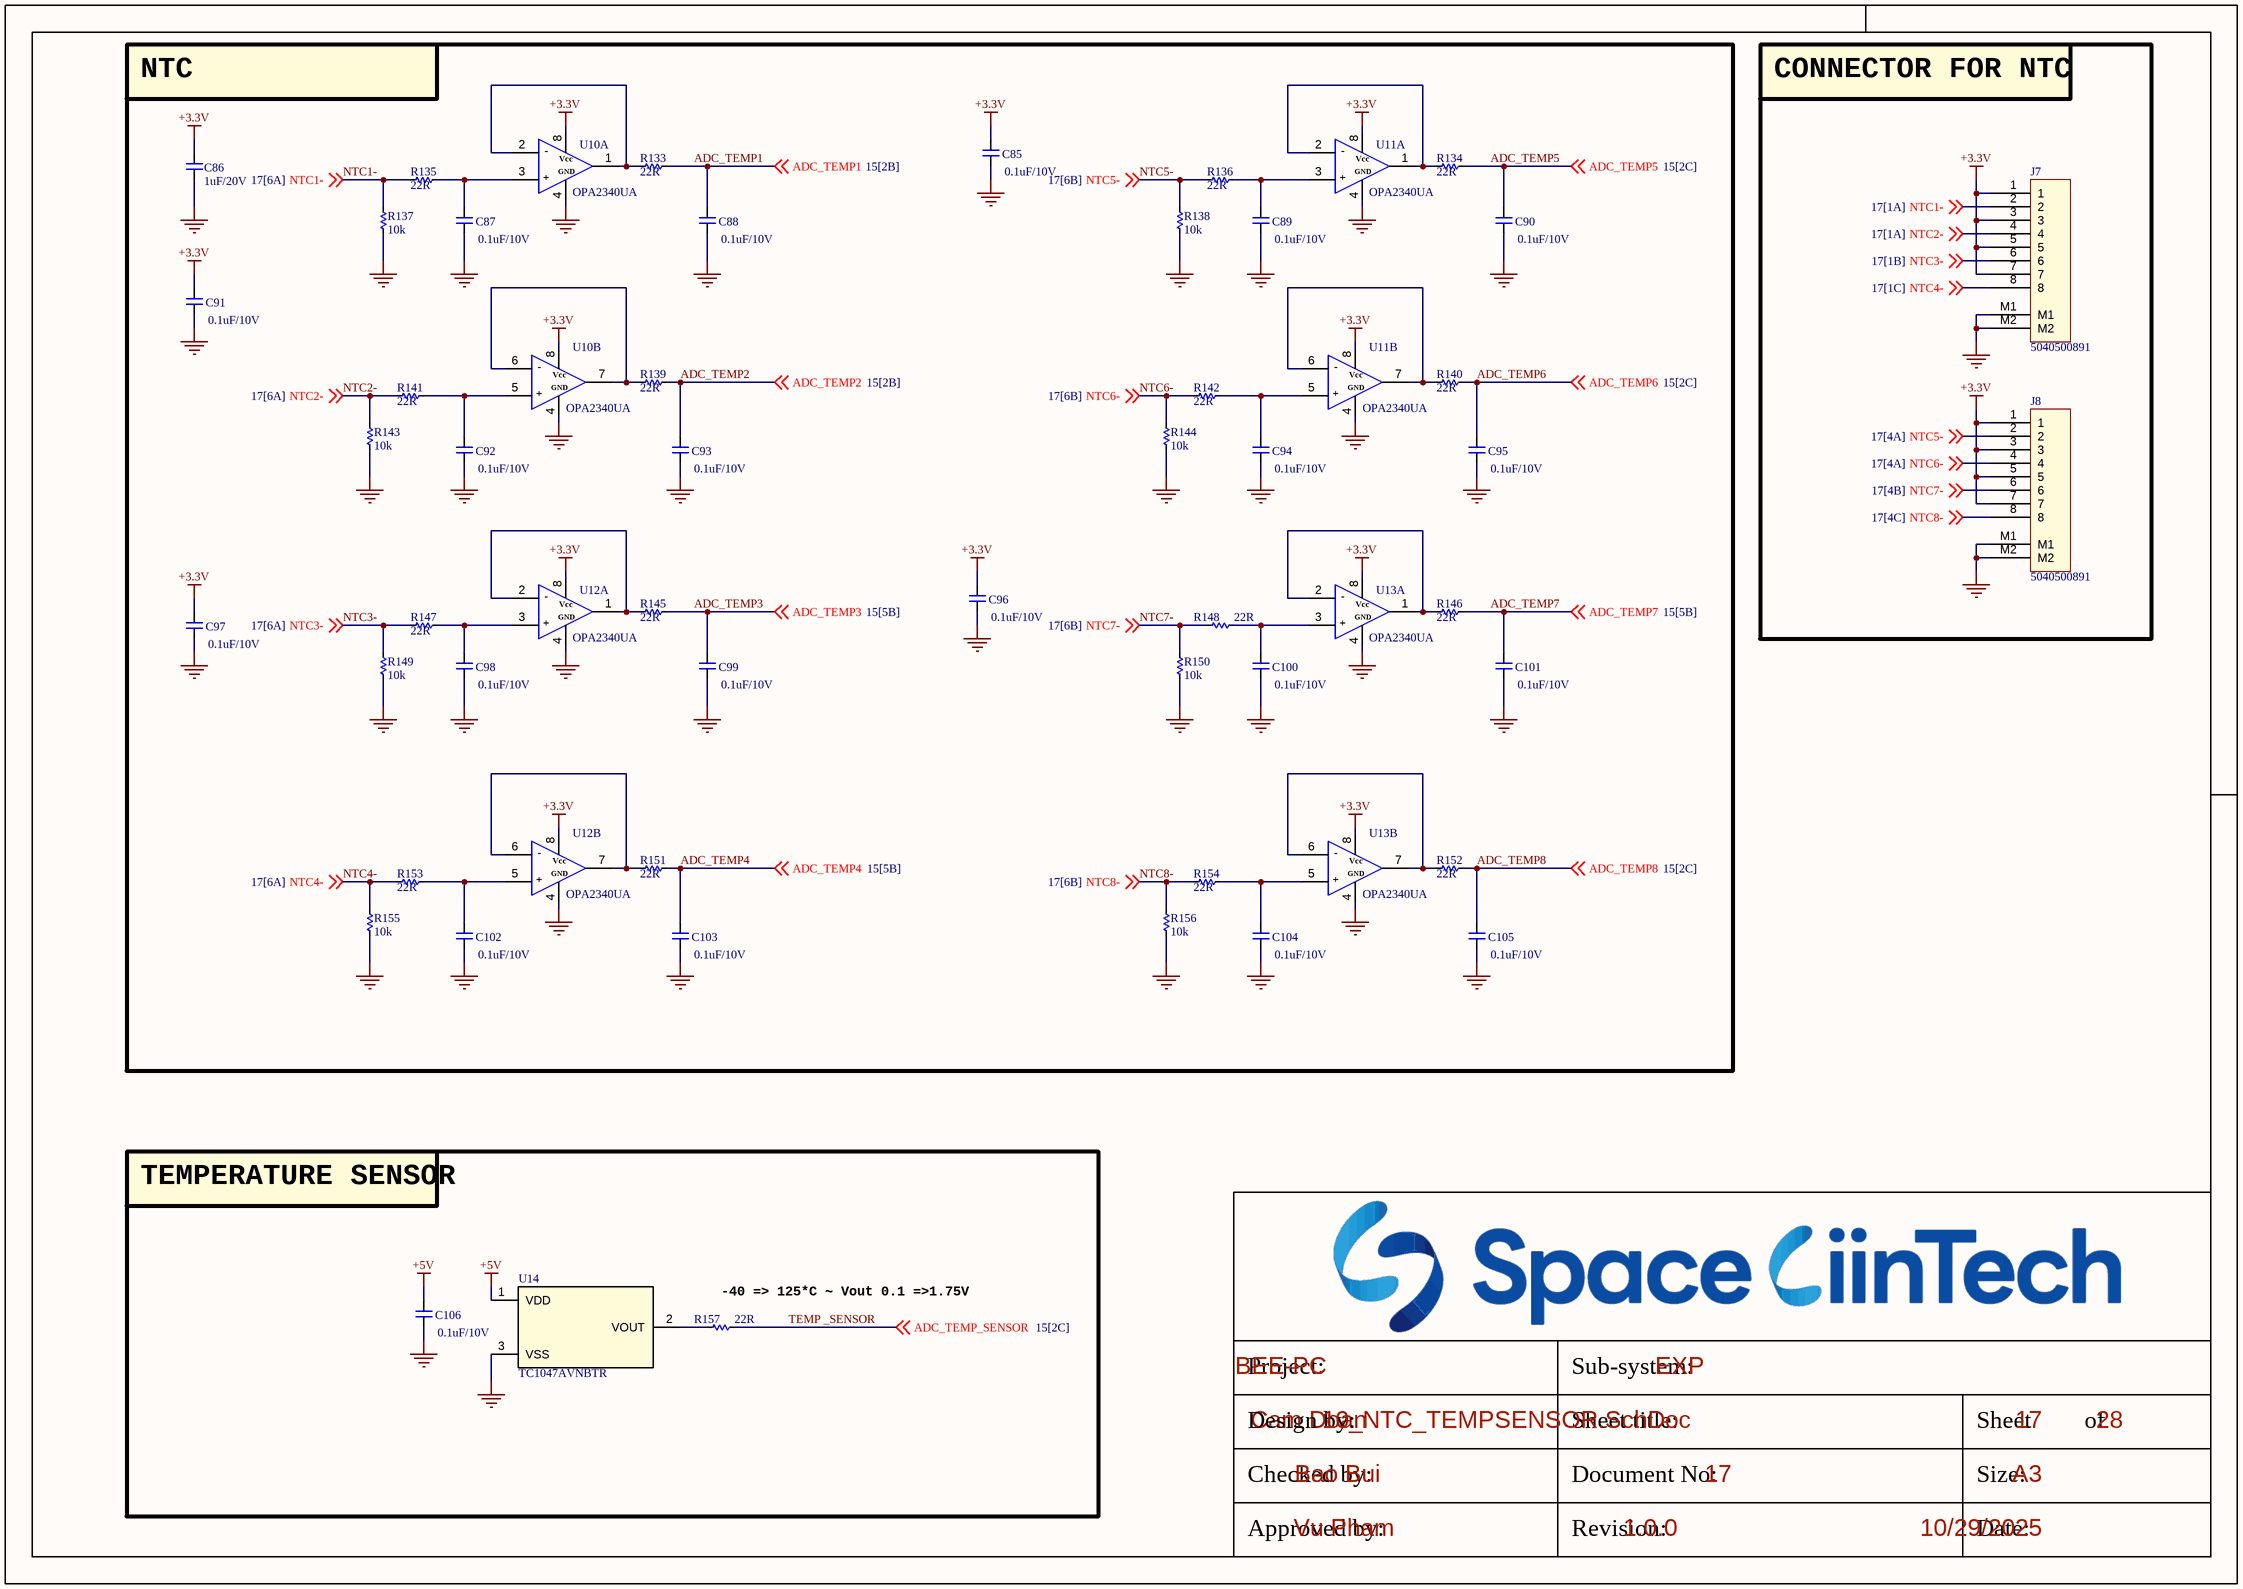
[diagram p18: 10_NTC_TEMPSENSOR.SchDoc]

### Parts
C85  0.1uF/10V  [CAP_C_1005X60]
C86  1uF/20V  [CAP_C_1005X60]
C87  0.1uF/10V  [CAP_C_1005X60]
C88  0.1uF/10V  [CAP_C_1005X60]
C89  0.1uF/10V  [CAP_C_1005X60]
C90  0.1uF/10V  [CAP_C_1005X60]
C91  0.1uF/10V  [CAP_C_1005X60]
C92  0.1uF/10V  [CAP_C_1005X60]
C93  0.1uF/10V  [CAP_C_1005X60]
C94  0.1uF/10V  [CAP_C_1005X60]
C95  0.1uF/10V  [CAP_C_1005X60]
C96  0.1uF/10V  [CAP_C_1005X60]
C97  0.1uF/10V  [CAP_C_1005X60]
C98  0.1uF/10V  [CAP_C_1005X60]
C99  0.1uF/10V  [CAP_C_1005X60]
C100  0.1uF/10V  [CAP_C_1005X60]
C101  0.1uF/10V  [CAP_C_1005X60]
C102  0.1uF/10V  [CAP_C_1005X60]
C103  0.1uF/10V  [CAP_C_1005X60]
C104  0.1uF/10V  [CAP_C_1005X60]
C105  0.1uF/10V  [CAP_C_1005X60]
C106  0.1uF/10V  [CAP_C_1005X60]
J7  5040500891  [MOLEX_5040500891]
J8  5040500891  [MOLEX_5040500891]
R133  22R  [RES_C_1005X40]
R134  22R  [RES_C_1005X40]
R135  22R  [RES_C_1005X40]
R136  22R  [RES_C_1005X40]
R137  10k  [RES_C_1005X40]
R138  10k  [RES_C_1005X40]
R139  22R  [RES_C_1005X40]
R140  22R  [RES_C_1005X40]
R141  22R  [RES_C_1005X40]
R142  22R  [RES_C_1005X40]
R143  10k  [RES_C_1005X40]
R144  10k  [RES_C_1005X40]
R145  22R  [RES_C_1005X40]
R146  22R  [RES_C_1005X40]
R147  22R  [RES_C_1005X40]
R148  22R  [RES_C_1005X40]
R149  10k  [RES_C_1005X40]
R150  10k  [RES_C_1005X40]
R151  22R  [RES_C_1005X40]
R152  22R  [RES_C_1005X40]
R153  22R  [RES_C_1005X40]
R154  22R  [RES_C_1005X40]
R155  10k  [RES_C_1005X40]
R156  10k  [RES_C_1005X40]
R157  22R  [RES_C_1005X40]
U10  OPA2340UA  [SOIC127P602X173-8N]  (parts A,B of 2)
U11  OPA2340UA  [SOIC127P602X173-8N]  (parts A,B of 2)
U12  OPA2340UA  [SOIC127P602X173-8N]  (parts A,B of 2)
U13  OPA2340UA  [SOIC127P602X173-8N]  (parts A,B of 2)
U14  TC1047AVNBTR  [SOT95P240X120-3N]

### Blocks framed on the sheet
NTC: C85-C105 R133-R156 U10-U13
CONNECTOR FOR NTC: J7 J8
TEMPERATURE SENSOR: C106 R157 U14

### Nets
+3.3V: C85.2 C86.2 C91.2 C96.2 C97.2 J7.1 J7.3 J7.5 J7.7 J8.1 J8.3 J8.5 J8.7 U10.8 U11.8 U12.8 U13.8
+5V: C106.2 U14.1(VDD)
GND: C85.1 C86.1 C87.1 C88.1 C89.1 C90.1 C91.1 C92.1 C93.1 C94.1 C95.1 C96.1 C97.1 C98.1 C99.1 C100.1 C101.1 C102.1 C103.1 C104.1 C105.1 C106.1 J7.M1 J7.M2 J8.M1 J8.M2 R137.1 R138.1 R143.1 R144.1 R149.1 R150.1 R155.1 R156.1 U10.4 U11.4 U12.4 U13.4 U14.3(VSS)
ADC_TEMP1: C88.2 R133.2 ; off-sheet ADC_TEMP1
ADC_TEMP2: C93.2 R139.2 ; off-sheet ADC_TEMP2
ADC_TEMP3: C99.2 R145.2 ; off-sheet ADC_TEMP3
ADC_TEMP4: C103.2 R151.2 ; off-sheet ADC_TEMP4
ADC_TEMP5: C90.2 R134.2 ; off-sheet ADC_TEMP5
ADC_TEMP6: C95.2 R140.2 ; off-sheet ADC_TEMP6
ADC_TEMP7: C101.2 R146.2 ; off-sheet ADC_TEMP7
ADC_TEMP8: C105.2 R152.2 ; off-sheet ADC_TEMP8
NTC1-: J7.2 R135.1 R137.2 ; off-sheet NTC1-
NTC2-: J7.4 R141.1 R143.2 ; off-sheet NTC2-
NTC3-: J7.6 R147.1 R149.2 ; off-sheet NTC3-
NTC4-: J7.8 R153.1 R155.2 ; off-sheet NTC4-
NTC5-: J8.2 R136.1 R138.2 ; off-sheet NTC5-
NTC6-: J8.4 R142.1 R144.2 ; off-sheet NTC6-
NTC7-: J8.6 R148.1 R150.2 ; off-sheet NTC7-
NTC8-: J8.8 R154.1 R156.2 ; off-sheet NTC8-
TEMP _SENSOR: R157.2 ; off-sheet ADC_TEMP_SENSOR  [also labelled ADC_TEMP_SENSOR]
NetC87_2: C87.2 R135.2 U10.3
NetC89_2: C89.2 R136.2 U11.3
NetC92_2: C92.2 R141.2 U10.5
NetC94_2: C94.2 R142.2 U11.5
NetC98_2: C98.2 R147.2 U12.3
NetC100_2: C100.2 R148.2 U13.3
NetC102_2: C102.2 R153.2 U12.5
NetC104_2: C104.2 R154.2 U13.5
NetR133_1: R133.1 U10.1 U10.2
NetR134_1: R134.1 U11.1 U11.2
NetR139_1: R139.1 U10.6 U10.7
NetR140_1: R140.1 U11.6 U11.7
NetR145_1: R145.1 U12.1 U12.2
NetR146_1: R146.1 U13.1 U13.2
NetR151_1: R151.1 U12.6 U12.7
NetR152_1: R152.1 U13.6 U13.7
NetR157_1: R157.1 U14.2(VOUT)

### Notes on the sheet
- (near R157) -40 => 125*C ~ Vout 0.1 =>1.75V
- Project:
- Sub-system:
- Design by:
- Sheet title:
- Sheet
- of
- Checked by:
- Approved by:
- Revision:
- Document No:
- Size:
- Date:
- A3
- (in symbol OPA2340UA, part A) -; Vcc; GND; +
- (in symbol OPA2340UA, part B) -; Vcc; GND; +

### Library data of the parts
C85-C106 = _CAP_C_2: CAP CHIP
J7 J8 = Header 8x1_2M
R133-R157 = _RES_B_2: RES
U14 = IC_SENSOR_TC1047AVNBTR: Temperature Sensor Analog, Local -40°C ~ 125°C 10mV/°C SOT-23-3

## Sheet 11_HEATER.SchDoc
size 420 x 297 mm; SheetNumber: 18; SheetTotal: 28
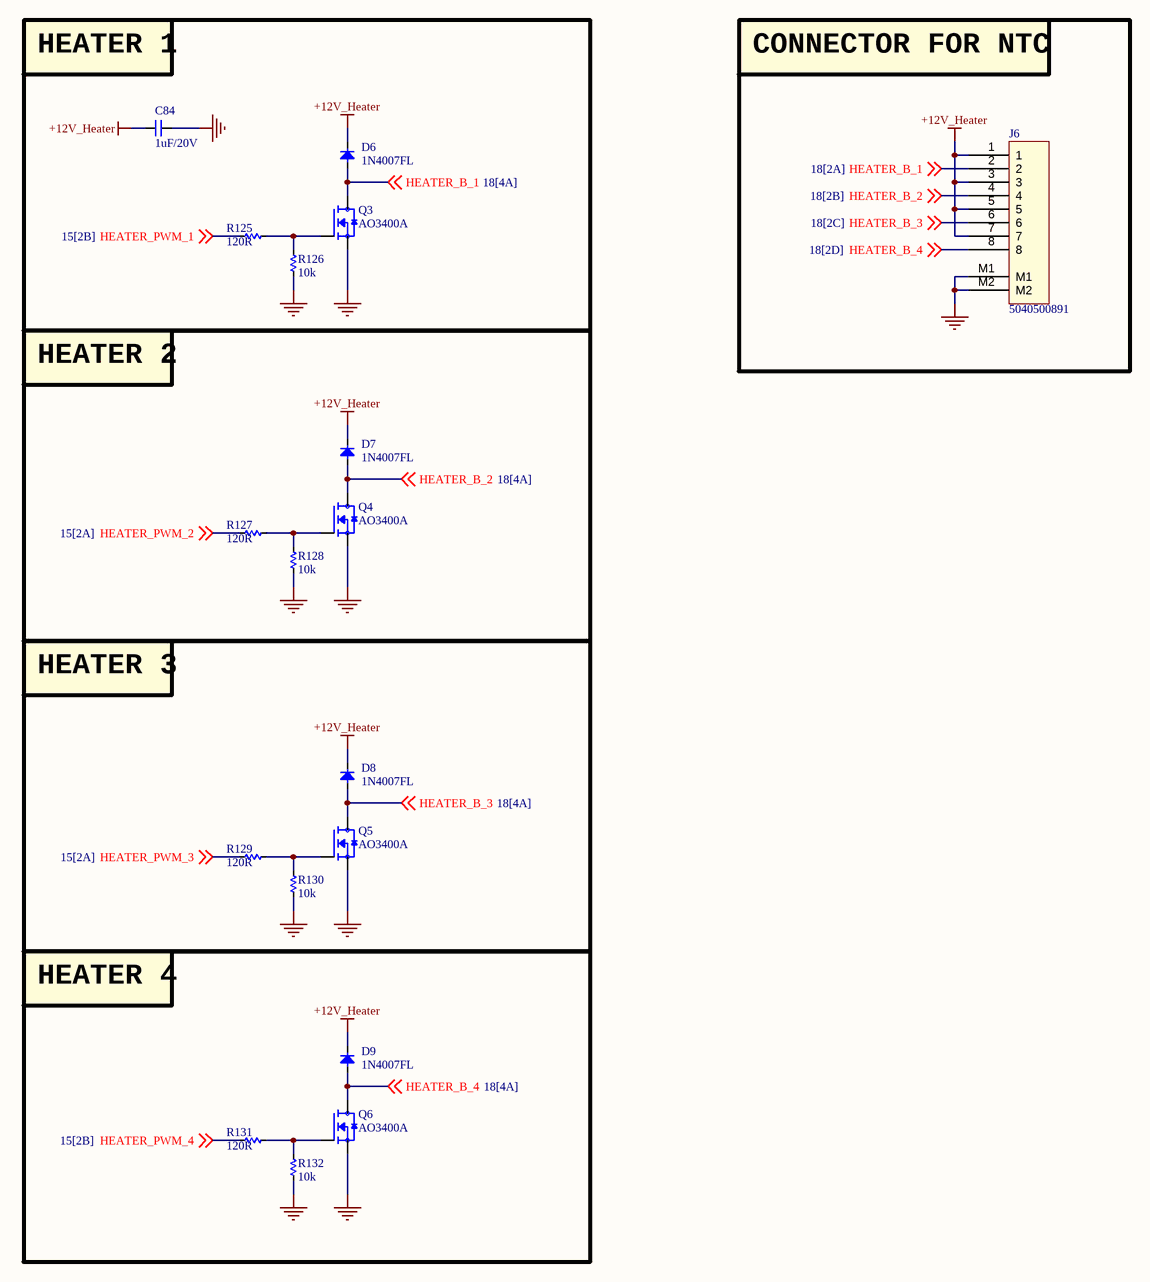
[diagram p19: 11_HEATER.SchDoc]

### Parts
C84  1uF/20V  [CAP_C_1005X60]
D6  1N4007FL  [SOD3717X145N]
D7  1N4007FL  [SOD3717X145N]
D8  1N4007FL  [SOD3717X145N]
D9  1N4007FL  [SOD3717X145N]
J6  5040500891  [MOLEX_5040500891]
Q3  AO3400A  [SOT95P240X120-3N]
Q4  AO3400A  [SOT95P240X120-3N]
Q5  AO3400A  [SOT95P240X120-3N]
Q6  AO3400A  [SOT95P240X120-3N]
R125  120R  [RES_C_1005X40]
R126  10k  [RES_C_1005X40]
R127  120R  [RES_C_1005X40]
R128  10k  [RES_C_1005X40]
R129  120R  [RES_C_1005X40]
R130  10k  [RES_C_1005X40]
R131  120R  [RES_C_1005X40]
R132  10k  [RES_C_1005X40]

### Blocks framed on the sheet
HEATER 1: C84 D6 Q3 R125 R126
CONNECTOR FOR NTC: J6
HEATER 2: D7 Q4 R127 R128
HEATER 3: D8 Q5 R129 R130
HEATER 4: D9 Q6 R131 R132

### Nets
+12V_Heater: C84.2 D6.1(K) D7.1(K) D8.1(K) D9.1(K) J6.1 J6.3 J6.5 J6.7
GND: C84.1 J6.M1 J6.M2 Q3.2(S) Q4.2(S) Q5.2(S) Q6.2(S) R126.1 R128.1 R130.1 R132.1
HEATER_B_1: D6.2(A) J6.2 Q3.3(D) ; off-sheet HEATER_B_1
HEATER_B_2: D7.2(A) J6.4 Q4.3(D) ; off-sheet HEATER_B_2
HEATER_B_3: D8.2(A) J6.6 Q5.3(D) ; off-sheet HEATER_B_3
HEATER_B_4: D9.2(A) J6.8 Q6.3(D) ; off-sheet HEATER_B_4
HEATER_PWM_1: R125.1 ; off-sheet HEATER_PWM_1
HEATER_PWM_2: R127.1 ; off-sheet HEATER_PWM_2
HEATER_PWM_3: R129.1 ; off-sheet HEATER_PWM_3
HEATER_PWM_4: R131.1 ; off-sheet HEATER_PWM_4
NetQ3_1: Q3.1(G) R125.2 R126.2
NetQ4_1: Q4.1(G) R127.2 R128.2
NetQ5_1: Q5.1(G) R129.2 R130.2
NetQ6_1: Q6.1(G) R131.2 R132.2

### Notes on the sheet
- Project:
- Sub-system:
- Design by:
- Sheet title:
- Sheet
- of
- Checked by:
- Approved by:
- Revision:
- Document No:
- Size:
- Date:
- A3

### Library data of the parts
C84 = _CAP_C_2: CAP CHIP
D6-D9 = Diode SMD: Default Diode; Code - JEDEC: DO-214-AB; Value: 1N5007; Published: 8-Jun-2000; Revision: July-2002: Re-released for DXP Platform.; Publisher: Altium Limited
J6 = Header 8x1_2M
Q3-Q6 = MOSFET_N: N-Channel 30 V 5.7A (Ta) 1.4W (Ta) Surface Mount SOT-23-3; MF: Alpha & Omega Semiconductor; SnapEDA_Link: https://www.snapeda.com/parts/AO3400A/Alpha/view-part/?ref=snap; Package: SOT-23 Alpha &amp; Omega Semiconductor Inc.; Value: *; MP: AO3400A; Check_prices: https://www.snapeda.com/parts/AO3400A/Alpha/view-part/?ref=eda
R125-R132 = _RES_B_2: RES

## Sheet 12_TEC.SchDoc
size 420 x 297 mm; SheetNumber: 19; SheetTotal: 29
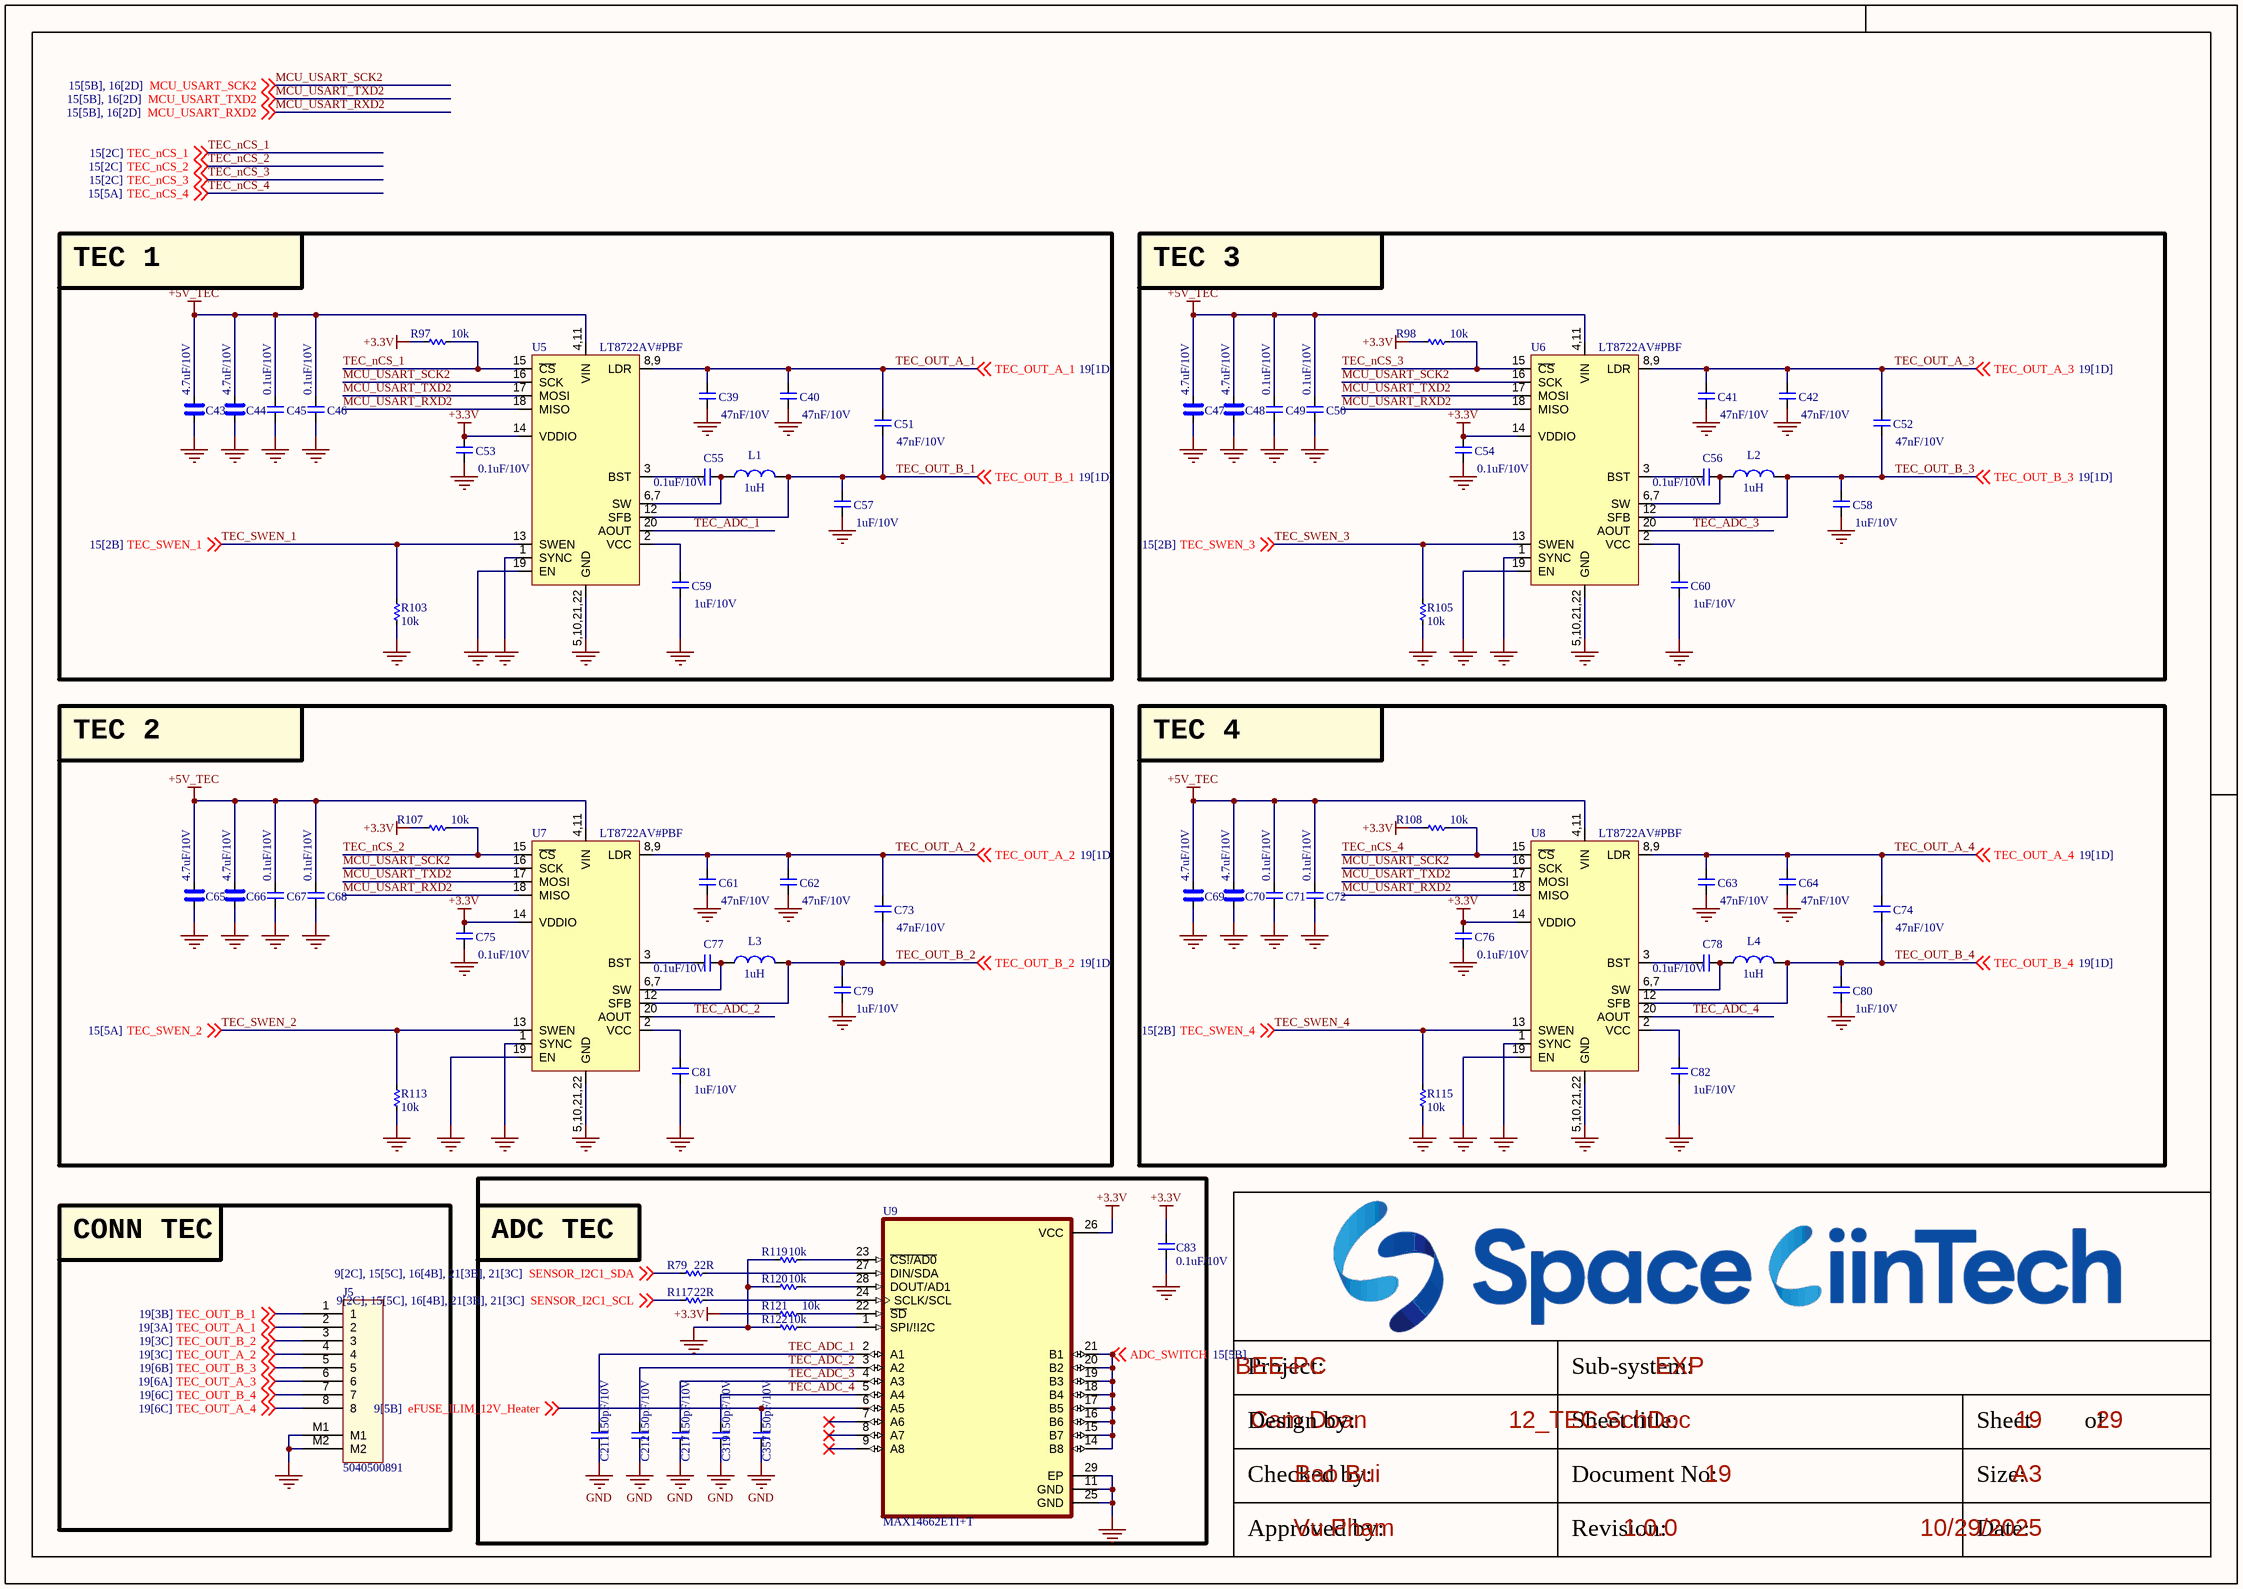
[diagram p20: 12_TEC.SchDoc]

### Parts
C39  47nF/10V  [CAP_C_1005X60]
C40  47nF/10V  [CAP_C_1005X60]
C41  47nF/10V  [CAP_C_1005X60]
C42  47nF/10V  [CAP_C_1005X60]
C43  4.7uF/10V  [CAP_C_1005X60]
C44  4.7uF/10V  [CAP_C_1005X60]
C45  0.1uF/10V  [CAP_C_1005X60]
C46  0.1uF/10V  [CAP_C_1005X60]
C47  4.7uF/10V  [CAP_C_1005X60]
C48  4.7uF/10V  [CAP_C_1005X60]
C49  0.1uF/10V  [CAP_C_1005X60]
C50  0.1uF/10V  [CAP_C_1005X60]
C51  47nF/10V  [CAP_C_1005X60]
C52  47nF/10V  [CAP_C_1005X60]
C53  0.1uF/10V  [CAP_C_1005X60]
C54  0.1uF/10V  [CAP_C_1005X60]
C55  0.1uF/10V  [CAP_C_1005X60]
C56  0.1uF/10V  [CAP_C_1005X60]
C57  1uF/10V  [CAP_C_1005X60]
C58  1uF/10V  [CAP_C_1005X60]
C59  1uF/10V  [CAP_C_1005X60]
C60  1uF/10V  [CAP_C_1005X60]
C61  47nF/10V  [CAP_C_1005X60]
C62  47nF/10V  [CAP_C_1005X60]
C63  47nF/10V  [CAP_C_1005X60]
C64  47nF/10V  [CAP_C_1005X60]
C65  4.7uF/10V  [CAP_C_1005X60]
C66  4.7uF/10V  [CAP_C_1005X60]
C67  0.1uF/10V  [CAP_C_1005X60]
C68  0.1uF/10V  [CAP_C_1005X60]
C69  4.7uF/10V  [CAP_C_1005X60]
C70  4.7uF/10V  [CAP_C_1005X60]
C71  0.1uF/10V  [CAP_C_1005X60]
C72  0.1uF/10V  [CAP_C_1005X60]
C73  47nF/10V  [CAP_C_1005X60]
C74  47nF/10V  [CAP_C_1005X60]
C75  0.1uF/10V  [CAP_C_1005X60]
C76  0.1uF/10V  [CAP_C_1005X60]
C77  0.1uF/10V  [CAP_C_1005X60]
C78  0.1uF/10V  [CAP_C_1005X60]
C79  1uF/10V  [CAP_C_1005X60]
C80  1uF/10V  [CAP_C_1005X60]
C81  1uF/10V  [CAP_C_1005X60]
C82  1uF/10V  [CAP_C_1005X60]
C83  0.1uF/10V  [CAP_C_1005X60]
C211  150pF/10V  [CAP_C_1005X60]
C212  150pF/10V  [CAP_C_1005X60]
C217  150pF/10V  [CAP_C_1005X60]
C319  150pF/10V  [CAP_C_1005X60]
C357  150pF/10V  [CAP_C_1005X60]
J5  5040500891  [MOLEX_5040500891]
L1  1uH  [L-SMD-M-3.5x3.5x2mm]
L2  1uH  [L-SMD-M-3.5x3.5x2mm]
L3  1uH  [L-SMD-M-3.5x3.5x2mm]
L4  1uH  [L-SMD-M-3.5x3.5x2mm]
R79  22R  [RES_C_1005X40]
R97  10k  [RES_C_1005X40]
R98  10k  [RES_C_1005X40]
R103  10k  [RES_C_1005X40]
R105  10k  [RES_C_1005X40]
R107  10k  [RES_C_1005X40]
R108  10k  [RES_C_1005X40]
R113  10k  [RES_C_1005X40]
R115  10k  [RES_C_1005X40]
R117  22R  [RES_C_1005X40]
R119  10k  [RES_C_1005X40]
R120  10k  [RES_C_1005X40]
R121  10k  [RES_C_1005X40]
R122  10k  [RES_C_1005X40]
U5  LT8722AV#PBF  [QFN18]
U6  LT8722AV#PBF  [QFN18]
U7  LT8722AV#PBF  [QFN18]
U8  LT8722AV#PBF  [QFN18]
U9  MAX14662ETI+T  [QFN40P400X400X80-29N]

### Blocks framed on the sheet
TEC 1: C39 C40 C43-C46 C51 C53 C55 C57 C59 L1 R97 R103 U5
TEC 3: C41 C42 C47-C50 C52 C54 C56 C58 C60 L2 R98 R105 U6
TEC 2: C61 C62 C65-C68 C73 C75 C77 C79 C81 L3 R107 R113 U7
TEC 4: C63 C64 C69-C72 C74 C76 C78 C80 C82 L4 R108 R115 U8
ADC TEC: C83 C211 C212 C217 C319 C357 R79 R117 R119-R122 U9
CONN TEC: J5

### Nets
+3.3V: C53.2 C54.2 C75.2 C76.2 C83.2 R97.1 R98.1 R107.1 R108.1 R121.1 U5.14(VDDIO) U6.14(VDDIO) U7.14(VDDIO) U8.14(VDDIO) U9.26(VCC)
+5V_TEC: C43.2 C44.2 C45.2 C46.2 C47.2 C48.2 C49.2 C50.2 C65.2 C66.2 C67.2 C68.2 C69.2 C70.2 C71.2 C72.2 U5.4,11(VIN) U6.4,11(VIN) U7.4,11(VIN) U8.4,11(VIN)
GND: C39.1 C40.1 C41.1 C42.1 C43.1 C44.1 C45.1 C46.1 C47.1 C48.1 C49.1 C50.1 C53.1 C54.1 C57.1 C58.1 C59.1 C60.1 C61.1 C62.1 C63.1 C64.1 C65.1 C66.1 C67.1 C68.1 C69.1 C70.1 C71.1 C72.1 C75.1 C76.1 C79.1 C80.1 C81.1 C82.1 C83.1 C211.1 C212.1 C217.1 C319.1 C357.1 J5.M1 J5.M2 R103.2 R105.2 R113.2 R115.2 R119.1 R120.1 R122.1 U5.1(SYNC) U5.5,10,21,22(GND) U5.19(EN) U6.1(SYNC) U6.5,10,21,22(GND) U6.19(EN) U7.1(SYNC) U7.5,10,21,22(GND) U7.19(EN) U8.1(SYNC) U8.5,10,21,22(GND) U8.19(EN) U9.11(GND) U9.25(GND) U9.29(EP)
ADC_SWITCH: U9.14(B8) U9.15(B7) U9.16(B6) U9.17(B5) U9.18(B4) U9.19(B3) U9.20(B2) U9.21(B1) ; off-sheet ADC_SWITCH
eFUSE_ILIM_12V_Heater: C357.2 U9.6(A5) ; off-sheet eFUSE_ILIM_12V_Heater
MCU_USART_RXD2: U5.18(MISO) U6.18(MISO) U7.18(MISO) U8.18(MISO) ; off-sheet MCU_USART_RXD2
MCU_USART_SCK2: U5.16(SCK) U6.16(SCK) U7.16(SCK) U8.16(SCK) ; off-sheet MCU_USART_SCK2
MCU_USART_TXD2: U5.17(MOSI) U6.17(MOSI) U7.17(MOSI) U8.17(MOSI) ; off-sheet MCU_USART_TXD2
SENSOR_I2C1_SCL: R117.1 ; off-sheet SENSOR_I2C1_SCL
SENSOR_I2C1_SDA: R79.1 ; off-sheet SENSOR_I2C1_SDA
TEC_ADC_1: C211.2 U5.20(AOUT) U9.2(A1)
TEC_ADC_2: C212.2 U7.20(AOUT) U9.3(A2)
TEC_ADC_3: C217.2 U6.20(AOUT) U9.4(A3)
TEC_ADC_4: C319.2 U8.20(AOUT) U9.5(A4)
TEC_nCS_1: R97.2 U5.15(~{CS}) ; off-sheet TEC_nCS_1
TEC_nCS_2: R107.2 U7.15(~{CS}) ; off-sheet TEC_nCS_2
TEC_nCS_3: R98.2 U6.15(~{CS}) ; off-sheet TEC_nCS_3
TEC_nCS_4: R108.2 U8.15(~{CS}) ; off-sheet TEC_nCS_4
TEC_OUT_A_1: C39.2 C40.2 C51.2 J5.2 U5.8,9(LDR) ; off-sheet TEC_OUT_A_1
TEC_OUT_A_2: C61.2 C62.2 C73.2 J5.4 U7.8,9(LDR) ; off-sheet TEC_OUT_A_2
TEC_OUT_A_3: C41.2 C42.2 C52.2 J5.6 U6.8,9(LDR) ; off-sheet TEC_OUT_A_3
TEC_OUT_A_4: C63.2 C64.2 C74.2 J5.8 U8.8,9(LDR) ; off-sheet TEC_OUT_A_4
TEC_OUT_B_1: C51.1 C57.2 J5.1 L1.2 U5.12(SFB) ; off-sheet TEC_OUT_B_1
TEC_OUT_B_2: C73.1 C79.2 J5.3 L3.2 U7.12(SFB) ; off-sheet TEC_OUT_B_2
TEC_OUT_B_3: C52.1 C58.2 J5.5 L2.2 U6.12(SFB) ; off-sheet TEC_OUT_B_3
TEC_OUT_B_4: C74.1 C80.2 J5.7 L4.2 U8.12(SFB) ; off-sheet TEC_OUT_B_4
TEC_SWEN_1: R103.1 U5.13(SWEN) ; off-sheet TEC_SWEN_1
TEC_SWEN_2: R113.1 U7.13(SWEN) ; off-sheet TEC_SWEN_2
TEC_SWEN_3: R105.1 U6.13(SWEN) ; off-sheet TEC_SWEN_3
TEC_SWEN_4: R115.1 U8.13(SWEN) ; off-sheet TEC_SWEN_4
NetC55_1: C55.1 L1.1 U5.6,7(SW)
NetC55_2: C55.2 U5.3(BST)
NetC56_1: C56.1 L2.1 U6.6,7(SW)
NetC56_2: C56.2 U6.3(BST)
NetC59_2: C59.2 U5.2(VCC)
NetC60_2: C60.2 U6.2(VCC)
NetC77_1: C77.1 L3.1 U7.6,7(SW)
NetC77_2: C77.2 U7.3(BST)
NetC78_1: C78.1 L4.1 U8.6,7(SW)
NetC78_2: C78.2 U8.3(BST)
NetC81_2: C81.2 U7.2(VCC)
NetC82_2: C82.2 U8.2(VCC)
NetR79_2: R79.2 U9.27(DIN/SDA)
NetR117_2: R117.2 U9.24(SCLK/SCL)
NetR119_2: R119.2 U9.23(~{CS!/AD0})
NetR120_2: R120.2 U9.28(DOUT/AD1)
NetR121_2: R121.2 U9.22(~{SD})
NetR122_2: R122.2 U9.1(SPI/!I2C)

Not connected (* = marked no-connect by the designer): U9 7(A6)* 8(A7)* 9(A8)*

### Notes on the sheet
- Project:
- Sub-system:
- Design by:
- Sheet title:
- Sheet
- of
- Checked by:
- Approved by:
- Revision:
- Document No:
- Size:
- Date:
- A3

### Library data of the parts
C39-C42 C45 C46 C49-C64 C67 C68 C71-C83 C211 C212 C217 C319 C357 = _CAP_C_2: CAP CHIP
C43 C44 C47 C48 C65 C66 C69 C70 = _CAP_C_High_2: CAP CHIP High Value
J5 = Header 8x1_2M
L1-L4 = L-SMD-1: partNo: 78477010; Manufacturer: Wurth Elektronik; Inductance: 1.0 μH; ComponentLink1Description: Manufacturer; ComponentLink1URL: http://www.we-online.de; Created by: Baojun Chen; Created Date: Nov.2015; ComponentLink2Description: Datasheet; ComponentLink2URL: http://katalog.we-online.de/pbs/datasheet/78477010.pdf
R79 R97 R98 R103 R105 R107 R108 R113 R115 R117 R119-R122 = _RES_B_2: RES
U5-U8 = LT8722
U9 = IC_SW_MAX14662ETI+T: 8 Circuit IC Switch 1:1 1Ohm 28-TQFN _4x4_; MF: Maxim Integrated; Package: TQFN-28 Maxim; Value: *; Price: None; MP: MAX14662ETI+T; SnapEDA_Link: https://www.snapeda.com/parts/MAX14662ETI%2BT/Maxim%20Integrated/view-part/546683/?ref=snap; Availability: Unavailable

## Sheet 13_FLOW_Sensor.SchDoc
size 420 x 297 mm; SheetNumber: 20; SheetTotal: 29
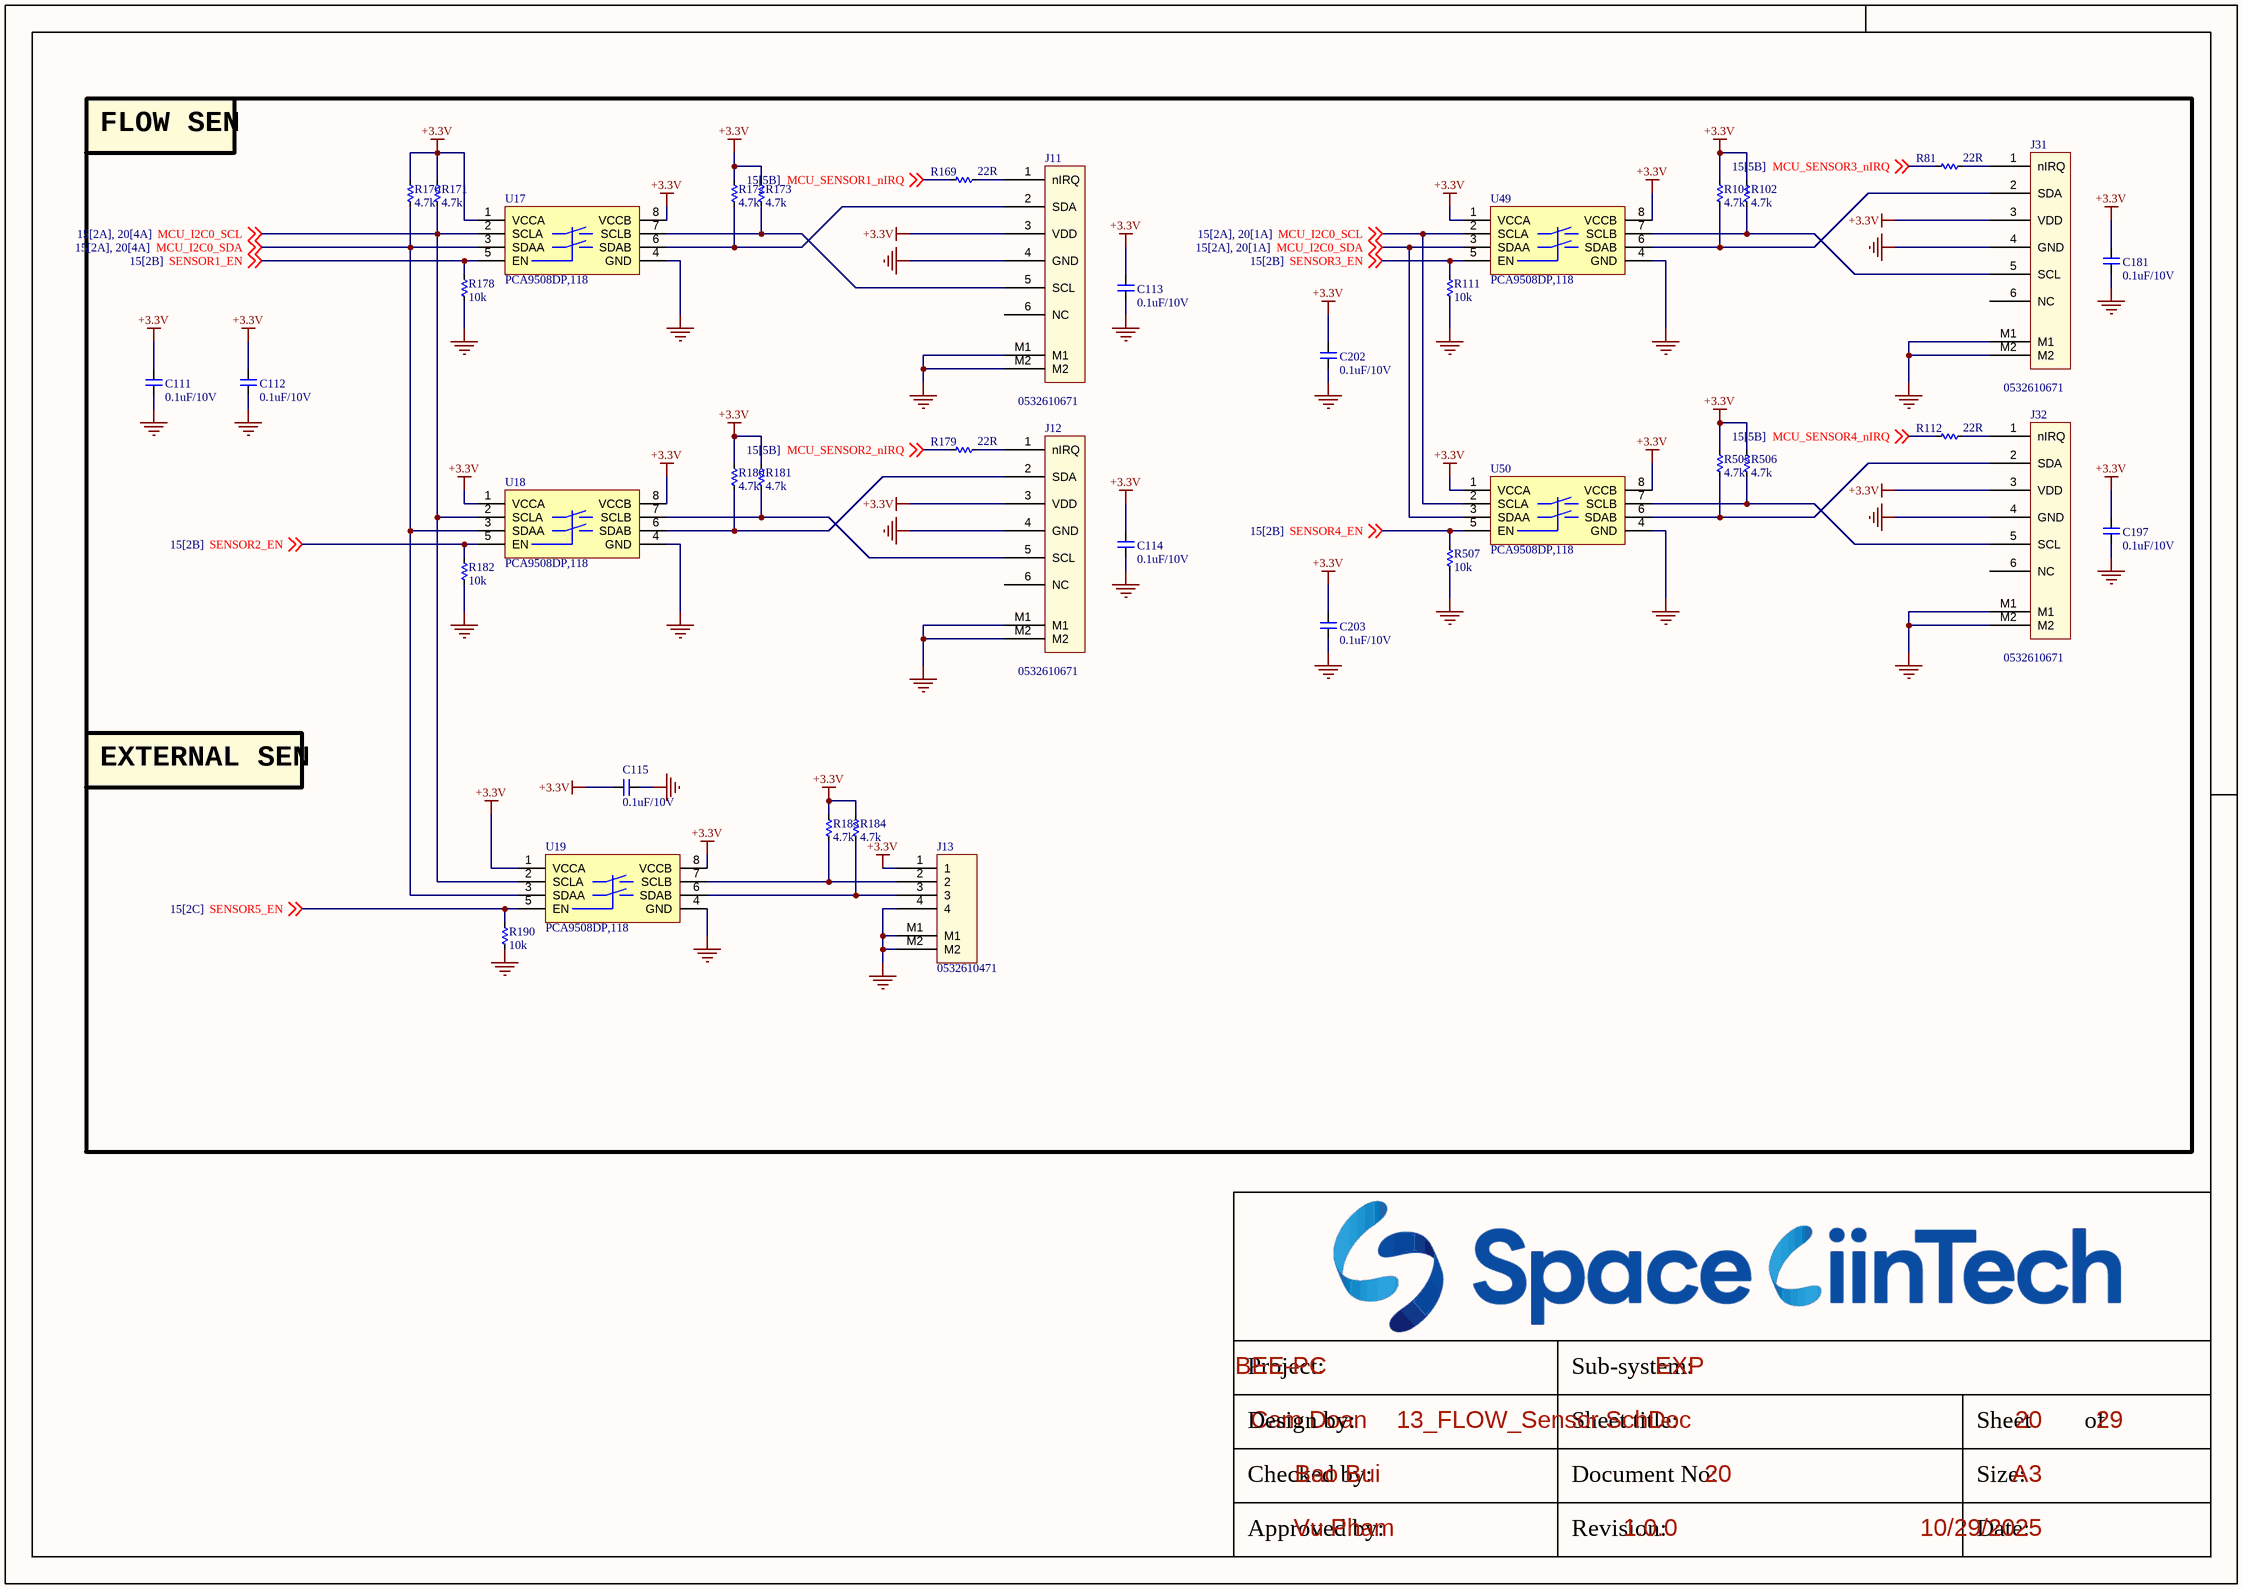
[diagram p21: 13_FLOW_Sensor.SchDoc]

### Parts
C111  0.1uF/10V  [CAP_C_1005X60]
C112  0.1uF/10V  [CAP_C_1005X60]
C113  0.1uF/10V  [CAP_C_1005X60]
C114  0.1uF/10V  [CAP_C_1005X60]
C115  0.1uF/10V  [CAP_C_1005X60]
C181  0.1uF/10V  [CAP_C_1005X60]
C197  0.1uF/10V  [CAP_C_1005X60]
C202  0.1uF/10V  [CAP_C_1005X60]
C203  0.1uF/10V  [CAP_C_1005X60]
J11  0532610671  [MOLEX_0532610671]
J12  0532610671  [MOLEX_0532610671]
J13  0532610471  [MOLEX_0532610471]
J31  0532610671  [MOLEX_0532610671]
J32  0532610671  [MOLEX_0532610671]
R81  22R  [RES_C_1005X40]
R101  4.7k  [RES_C_1005X40]
R102  4.7k  [RES_C_1005X40]
R111  10k  [RES_C_1005X40]
R112  22R  [RES_C_1005X40]
R169  22R  [RES_C_1005X40]
R170  4.7k  [RES_C_1005X40]
R171  4.7k  [RES_C_1005X40]
R172  4.7k  [RES_C_1005X40]
R173  4.7k  [RES_C_1005X40]
R178  10k  [RES_C_1005X40]
R179  22R  [RES_C_1005X40]
R180  4.7k  [RES_C_1005X40]
R181  4.7k  [RES_C_1005X40]
R182  10k  [RES_C_1005X40]
R183  4.7k  [RES_C_1005X40]
R184  4.7k  [RES_C_1005X40]
R190  10k  [RES_C_1005X40]
R505  4.7k  [RES_C_1005X40]
R506  4.7k  [RES_C_1005X40]
R507  10k  [RES_C_1005X40]
U17  PCA9508DP,118  [TSOP8]
U18  PCA9508DP,118  [TSOP8]
U19  PCA9508DP,118  [TSOP8]
U49  PCA9508DP,118  [TSOP8]
U50  PCA9508DP,118  [TSOP8]

### Nets
+3.3V: C111.2 C112.2 C113.2 C114.2 C115.2 C181.2 C197.2 C202.2 C203.2 J11.3(VDD) J12.3(VDD) J13.1 J31.3(VDD) J32.3(VDD) R101.1 R102.1 R170.1 R171.1 R172.1 R173.1 R180.1 R181.1 R183.1 R184.1 R505.1 R506.1 U17.1(VCCA) U17.8(VCCB) U18.1(VCCA) U18.8(VCCB) U19.1(VCCA) U19.8(VCCB) U49.1(VCCA) U49.8(VCCB) U50.1(VCCA) U50.8(VCCB)
GND: C111.1 C112.1 C113.1 C114.1 C115.1 C181.1 C197.1 C202.1 C203.1 J11.4(GND) J11.M1 J11.M2 J12.4(GND) J12.M1 J12.M2 J13.4 J13.M1 J13.M2 J31.4(GND) J31.M1 J31.M2 J32.4(GND) J32.M1 J32.M2 R111.2 R178.2 R182.2 R190.2 R507.2 U17.4(GND) U18.4(GND) U19.4(GND) U49.4(GND) U50.4(GND)
MCU_I2C0_SCL: R171.2 U17.2(SCLA) U18.2(SCLA) U19.2(SCLA) U49.2(SCLA) U50.2(SCLA) ; off-sheet MCU_I2C0_SCL
MCU_I2C0_SDA: R170.2 U17.3(SDAA) U18.3(SDAA) U19.3(SDAA) U49.3(SDAA) U50.3(SDAA) ; off-sheet MCU_I2C0_SDA
MCU_SENSOR1_nIRQ: R169.2 ; off-sheet MCU_SENSOR1_nIRQ
MCU_SENSOR2_nIRQ: R179.2 ; off-sheet MCU_SENSOR2_nIRQ
MCU_SENSOR3_nIRQ: R81.2 ; off-sheet MCU_SENSOR3_nIRQ
MCU_SENSOR4_nIRQ: R112.2 ; off-sheet MCU_SENSOR4_nIRQ
SENSOR1_EN: R178.1 U17.5(EN) ; off-sheet SENSOR1_EN
SENSOR2_EN: R182.1 U18.5(EN) ; off-sheet SENSOR2_EN
SENSOR3_EN: R111.1 U49.5(EN) ; off-sheet SENSOR3_EN
SENSOR4_EN: R507.1 U50.5(EN) ; off-sheet SENSOR4_EN
SENSOR5_EN: R190.1 U19.5(EN) ; off-sheet SENSOR5_EN
NetJ11_1: J11.1(nIRQ) R169.1
NetJ11_2: J11.2(SDA) R172.2 U17.6(SDAB)
NetJ11_5: J11.5(SCL) R173.2 U17.7(SCLB)
NetJ12_1: J12.1(nIRQ) R179.1
NetJ12_2: J12.2(SDA) R180.2 U18.6(SDAB)
NetJ12_5: J12.5(SCL) R181.2 U18.7(SCLB)
NetJ13_2: J13.2 R183.2 U19.7(SCLB)
NetJ13_3: J13.3 R184.2 U19.6(SDAB)
NetJ31_1: J31.1(nIRQ) R81.1
NetJ31_2: J31.2(SDA) R101.2 U49.6(SDAB)
NetJ31_5: J31.5(SCL) R102.2 U49.7(SCLB)
NetJ32_1: J32.1(nIRQ) R112.1
NetJ32_2: J32.2(SDA) R505.2 U50.6(SDAB)
NetJ32_5: J32.5(SCL) R506.2 U50.7(SCLB)

Not connected (* = marked no-connect by the designer): J11 6(NC); J12 6(NC); J31 6(NC); J32 6(NC)

### Notes on the sheet
- FLOW SEN
- EXTERNAL SEN
- Project:
- Sub-system:
- Design by:
- Sheet title:
- Sheet
- of
- Checked by:
- Approved by:
- Revision:
- Document No:
- Size:
- Date:
- A3

### Library data of the parts
C111-C115 C181 C197 C202 C203 = _CAP_C_2: CAP CHIP
J11 J12 J31 J32 = FLOW_SENSOR
J13 = Header 4x1_2M
R81 R101 R102 R111 R112 R169-R173 R178-R184 R190 R505-R507 = _RES_B_2: RES

## Sheet 13_Sensors_Onboard.SchDoc
size 420 x 297 mm; SheetNumber: 21; SheetTotal: 29
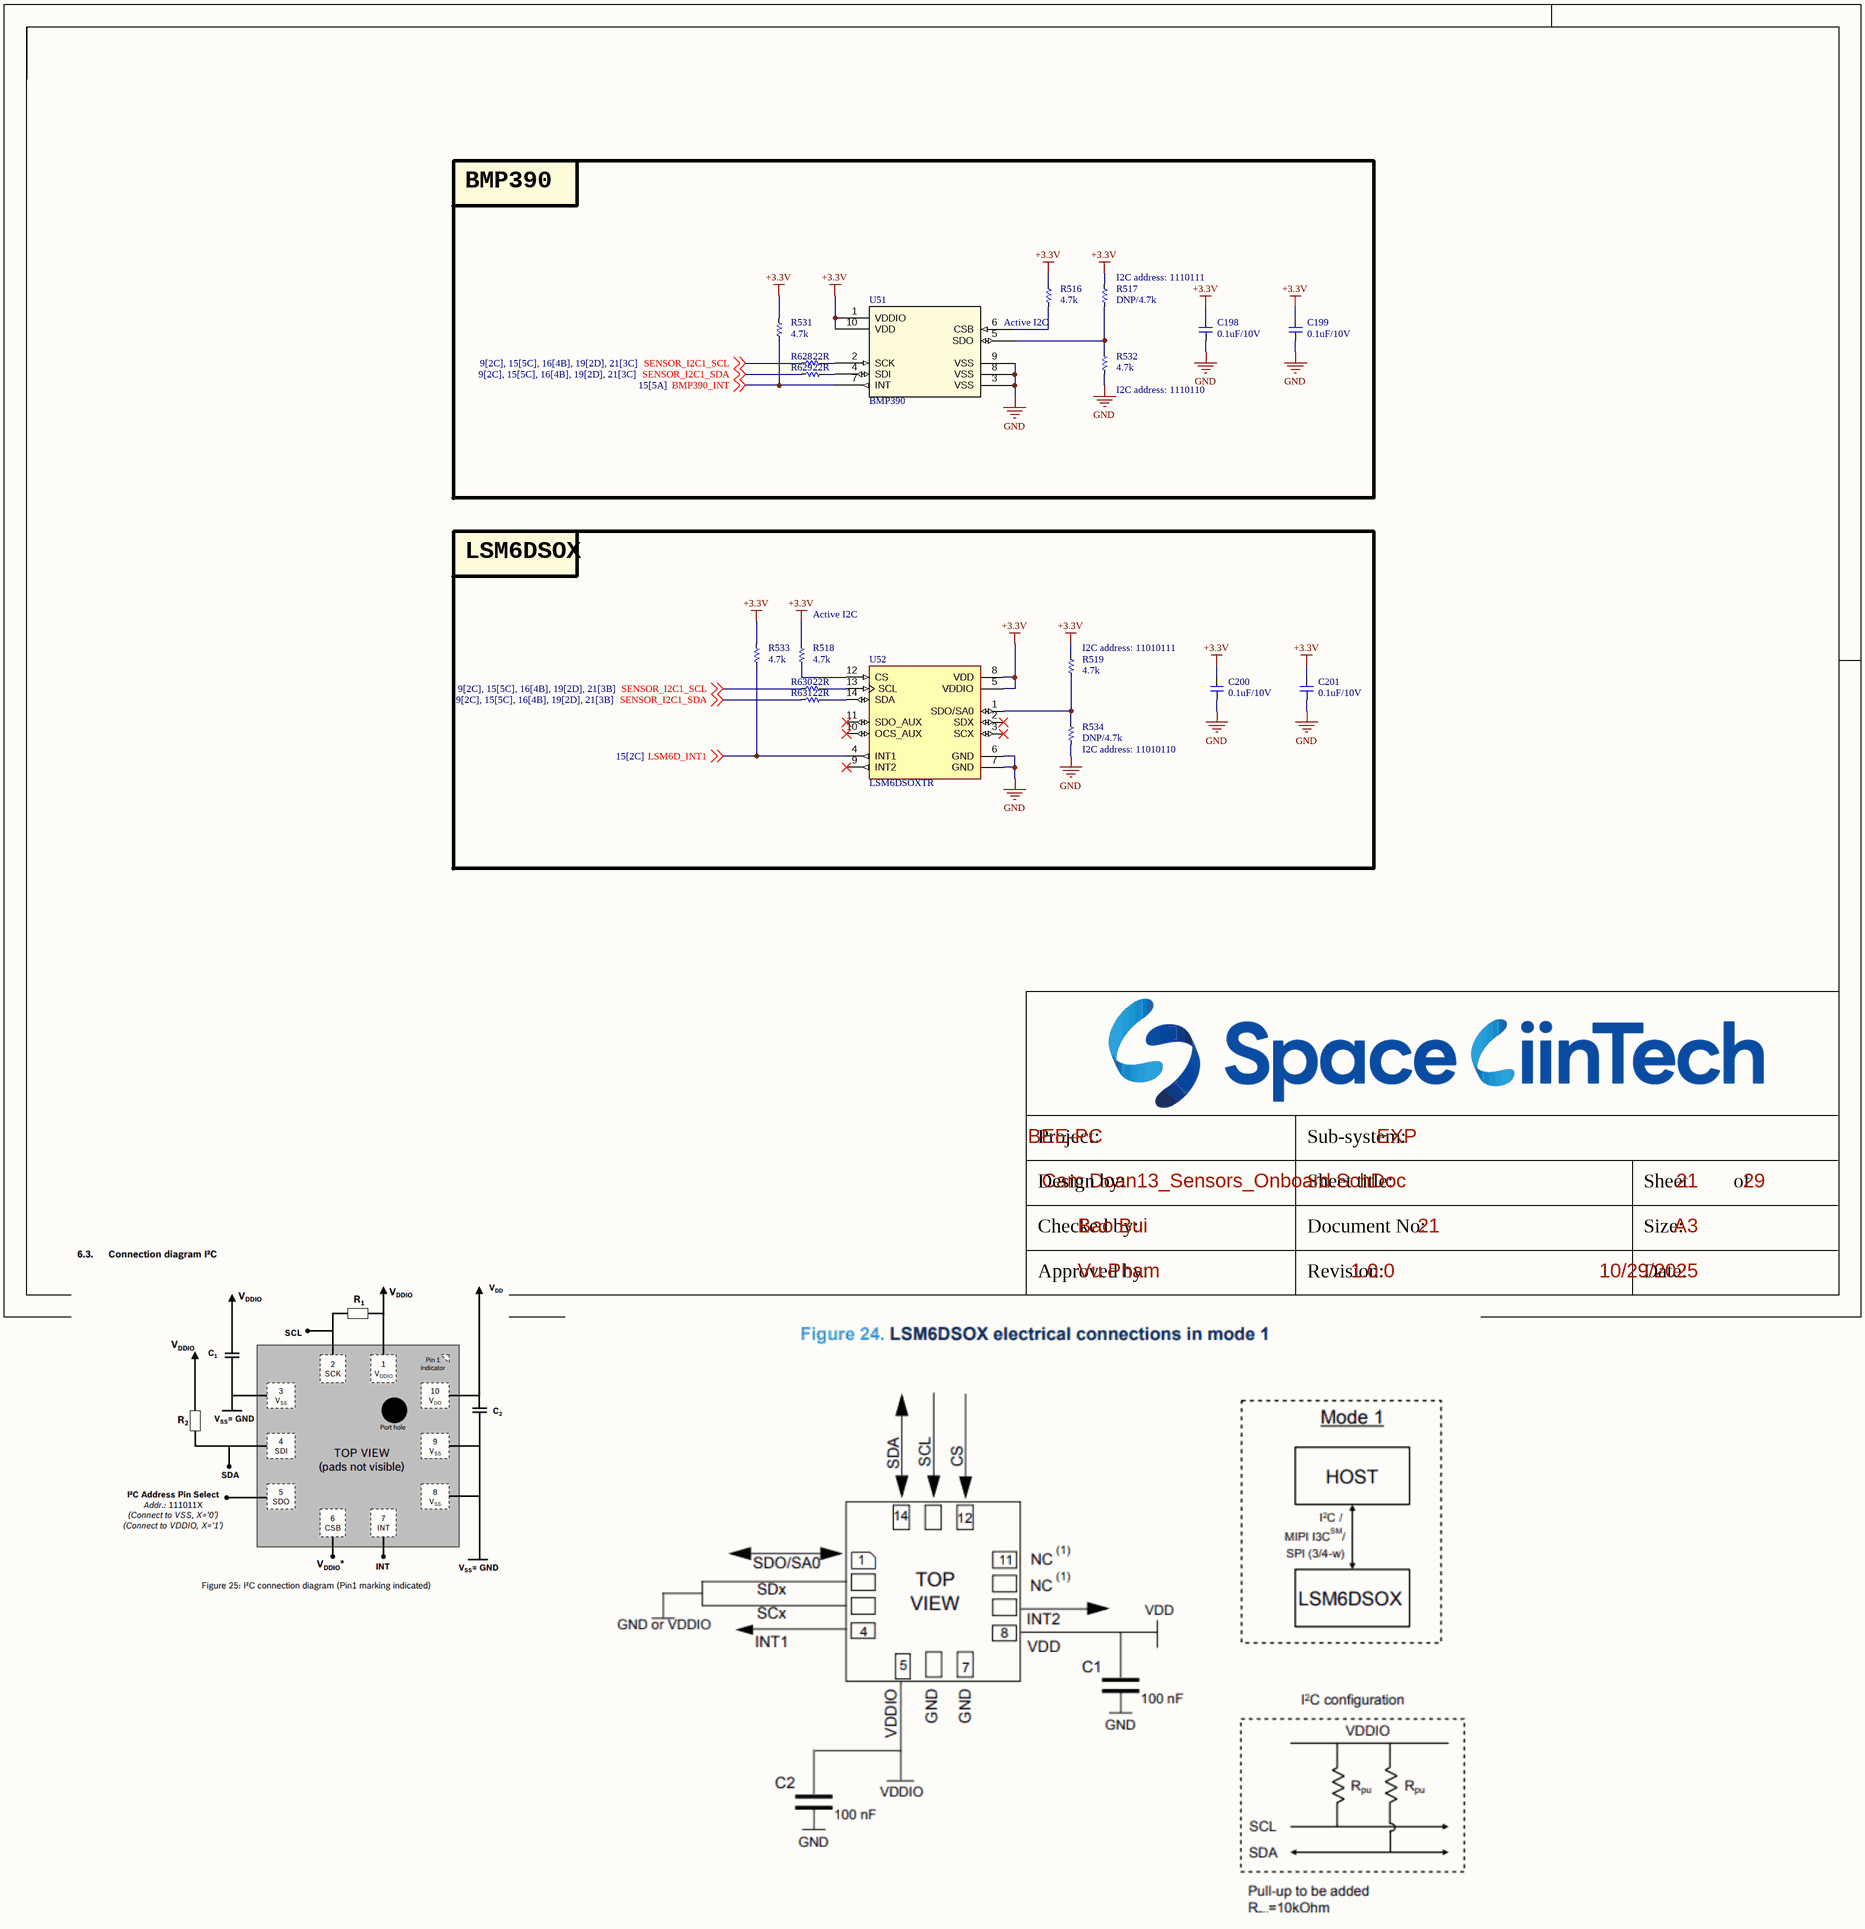
[diagram p22: 13_Sensors_Onboard.SchDoc]

### Parts
C198  0.1uF/10V  [CAP_C_1005X60]
C199  0.1uF/10V  [CAP_C_1005X60]
C200  0.1uF/10V  [CAP_C_1005X60]
C201  0.1uF/10V  [CAP_C_1005X60]
R516  4.7k  [RES_C_1005X40]
R517  DNP/4.7k  [RES_C_1005X40]
R518  4.7k  [RES_C_1005X40]
R519  4.7k  [RES_C_1005X40]
R531  4.7k  [RES_C_1005X40]
R532  4.7k  [RES_C_1005X40]
R533  4.7k  [RES_C_1005X40]
R534  DNP/4.7k  [RES_C_1005X40]
R628  22R  [RES_C_1005X40]
R629  22R  [RES_C_1005X40]
R630  22R  [RES_C_1005X40]
R631  22R  [RES_C_1005X40]
U51  BMP390  [10LGA_2X2X0p75_BOS]
U52  LSM6DSOXTR  [PQFN50P250X300X86-14N]

### Blocks framed on the sheet
BMP390: C198 C199 R516 R517 R531 R532 R628 R629 U51
LSM6DSOX: C200 C201 R518 R519 R533 R534 R630 R631 U52

### Nets
+3.3V: C198.2 C199.2 C200.2 C201.2 R516.1 R517.1 R518.1 R519.1 R531.1 R533.1 U51.1(VDDIO) U51.10(VDD) U52.5(VDDIO) U52.8(VDD)
GND: C198.1 C199.1 C200.1 C201.1 R532.2 R534.2 U51.3(VSS) U51.8(VSS) U51.9(VSS) U52.6(GND) U52.7(GND)
BMP390_INT: R531.2 U51.7(INT) ; off-sheet BMP390_INT
LSM6D_INT1: R533.2 U52.4(INT1) ; off-sheet LSM6D_INT1
SENSOR_I2C1_SCL: R628.1 R630.1 ; off-sheet SENSOR_I2C1_SCL
SENSOR_I2C1_SDA: R629.1 R631.1 ; off-sheet SENSOR_I2C1_SDA
NetR516_2: R516.2 U51.6(CSB)
NetR517_2: R517.2 R532.1 U51.5(SDO)
NetR518_2: R518.2 U52.12(CS)
NetR519_2: R519.2 R534.1 U52.1(SDO/SA0)
NetR628_2: R628.2 U51.2(SCK)
NetR629_2: R629.2 U51.4(SDI)
NetR630_2: R630.2 U52.13(SCL)
NetR631_2: R631.2 U52.14(SDA)

Not connected (* = marked no-connect by the designer): U52 2(SDX)* 3(SCX)* 9(INT2)* 10(OCS_AUX)* 11(SDO_AUX)*

### Notes on the sheet
- Active I2C
- (near R517) I2C address: 1110111
- (near R532) I2C address: 1110110
- (near R518) Active I2C
- (near R519) I2C address: 11010111
- (near R534) I2C address: 11010110
- Project:
- Sub-system:
- Design by:
- Sheet title:
- Sheet
- of
- Checked by:
- Approved by:
- Revision:
- Document No:
- Size:
- Date:
- A3

### Library data of the parts
C198-C201 = _CAP_C_2: CAP CHIP
R516-R519 R531-R534 R628-R631 = _RES_B_2: RES
U51 = BMP390: Description; Manufacturer_Name: Bosch Sensortec; Copyright: Copyright (C) 2025 Ultra Librarian. All rights reserved.; Manufacturer_Part_Number: BMP390; RefDes: RefDes; Type: Type
U52 = LSM6DSOXTR: Accelerometer, Gyroscope, 6 Axis Sensor I2C, SPI Output; MF: STMicroelectronics; SnapEDA_Link: https://www.snapeda.com/parts/LSM6DSOXTR/STMicroelectronics/view-part/?ref=snap; Package: VFLGA-14 STMicroelectronics; Value: *; MP: LSM6DSOXTR; Check_prices: https://www.snapeda.com/parts/LSM6DSOXTR/STMicroelectronics/view-part/?ref=eda

## Sheet 14_HD4_PUMP.SchDoc
size 420 x 297 mm; SheetNumber: 22; SheetTotal: 29
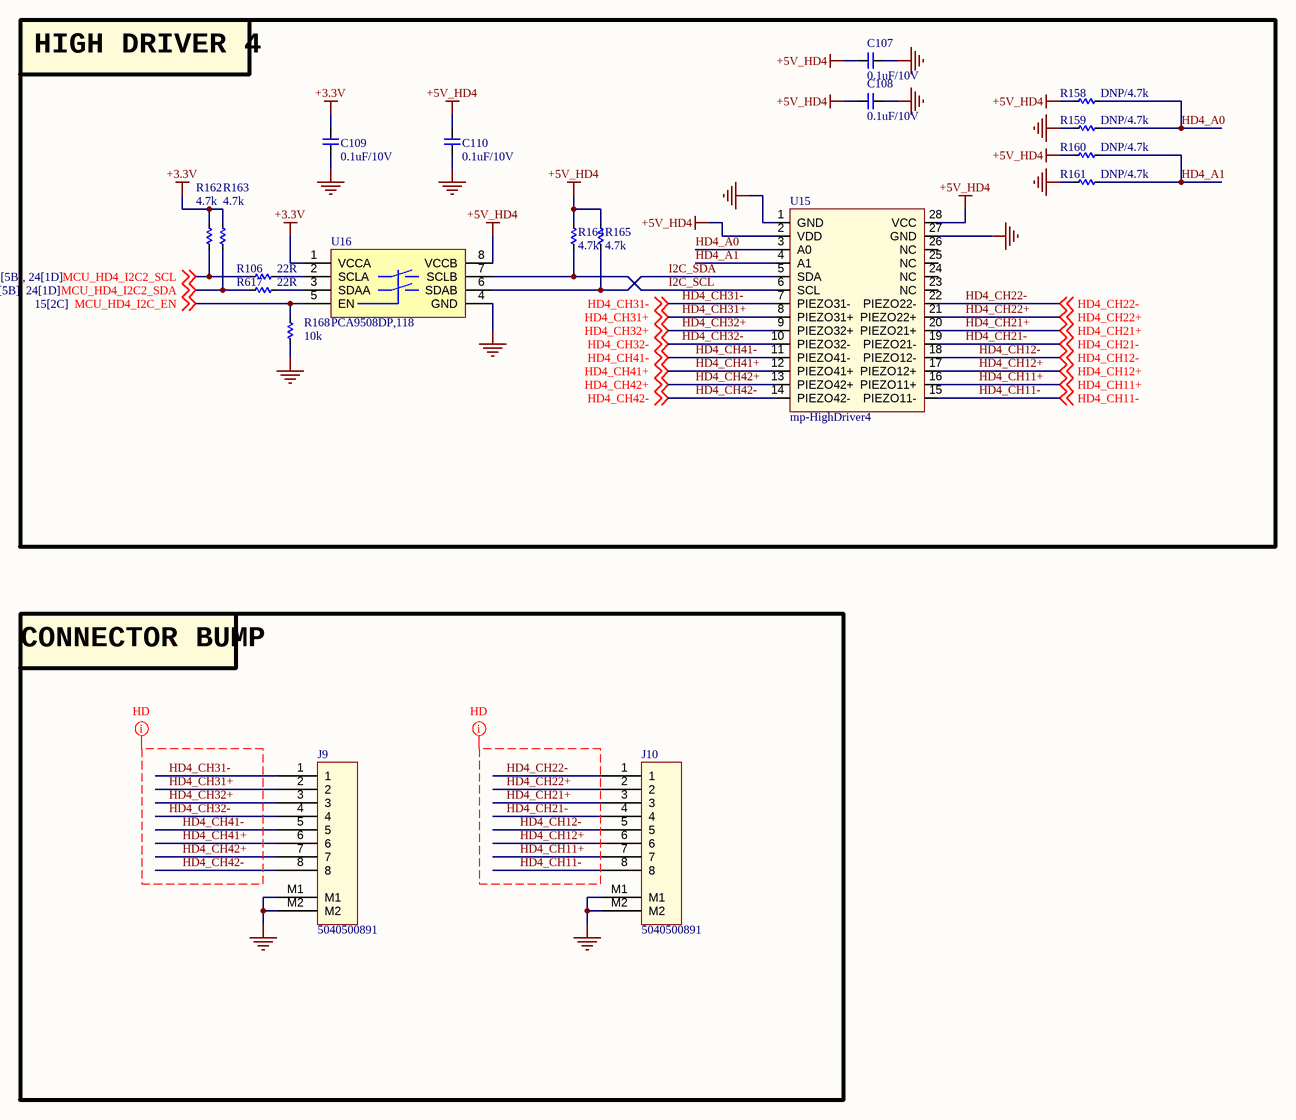
[diagram p23: 14_HD4_PUMP.SchDoc]

### Parts
C107  0.1uF/10V  [CAP_C_1005X60]
C108  0.1uF/10V  [CAP_C_1005X60]
C109  0.1uF/10V  [CAP_C_1005X60]
C110  0.1uF/10V  [CAP_C_1005X60]
J9  5040500891  [MOLEX_5040500891]
J10  5040500891  [MOLEX_5040500891]
R106  22R  [RES_C_1005X40]
R158  DNP/4.7k  [RES_C_1005X40]
R159  DNP/4.7k  [RES_C_1005X40]
R160  DNP/4.7k  [RES_C_1005X40]
R161  DNP/4.7k  [RES_C_1005X40]
R162  4.7k  [RES_C_1005X40]
R163  4.7k  [RES_C_1005X40]
R164  4.7k  [RES_C_1005X40]
R165  4.7k  [RES_C_1005X40]
R168  10k  [RES_C_1005X40]
R617  22R  [RES_C_1005X40]
U15  mp-HighDriver4  [MP_HIGHDRIVER4]
U16  PCA9508DP,118  [TSOP8]

### Blocks framed on the sheet
HIGH DRIVER 4: C107-C110 R106 R158-R165 R168 R617 U15 U16
CONNECTOR BUMP: J9 J10

### Nets
+3.3V: C109.2 R162.1 R163.1 U16.1(VCCA)
+5V_HD4: C107.2 C108.2 C110.2 R158.1 R160.1 R164.1 R165.1 U15.2(VDD) U15.28(VCC) U16.8(VCCB)
GND: C107.1 C108.1 C109.1 C110.1 J9.M1 J9.M2 J10.M1 J10.M2 R159.1 R161.1 R168.2 U15.1(GND) U15.27(GND) U16.4(GND)
HD4_A0: R158.2 R159.2 U15.3(A0)
HD4_A1: R160.2 R161.2 U15.4(A1)
HD4_CH11+: J10.7 U15.16(PIEZO11+) ; off-sheet HD4_CH11+
HD4_CH11-: J10.8 U15.15(PIEZO11-) ; off-sheet HD4_CH11-
HD4_CH12+: J10.6 U15.17(PIEZO12+) ; off-sheet HD4_CH12+
HD4_CH12-: J10.5 U15.18(PIEZO12-) ; off-sheet HD4_CH12-
HD4_CH21+: J10.3 U15.20(PIEZO21+) ; off-sheet HD4_CH21+
HD4_CH21-: J10.4 U15.19(PIEZO21-) ; off-sheet HD4_CH21-
HD4_CH22+: J10.2 U15.21(PIEZO22+) ; off-sheet HD4_CH22+
HD4_CH22-: J10.1 U15.22(PIEZO22-) ; off-sheet HD4_CH22-
HD4_CH31+: J9.2 U15.8(PIEZO31+) ; off-sheet HD4_CH31+
HD4_CH31-: J9.1 U15.7(PIEZO31-) ; off-sheet HD4_CH31-
HD4_CH32+: J9.3 U15.9(PIEZO32+) ; off-sheet HD4_CH32+
HD4_CH32-: J9.4 U15.10(PIEZO32-) ; off-sheet HD4_CH32-
HD4_CH41+: J9.6 U15.12(PIEZO41+) ; off-sheet HD4_CH41+
HD4_CH41-: J9.5 U15.11(PIEZO41-) ; off-sheet HD4_CH41-
HD4_CH42+: J9.7 U15.13(PIEZO42+) ; off-sheet HD4_CH42+
HD4_CH42-: J9.8 U15.14(PIEZO42-) ; off-sheet HD4_CH42-
I2C_SCL: R164.2 U15.6(SCL) U16.7(SCLB)
I2C_SDA: R165.2 U15.5(SDA) U16.6(SDAB)
MCU_HD4_I2C2_SCL: R106.2 R162.2 ; off-sheet MCU_HD4_I2C2_SCL
MCU_HD4_I2C2_SDA: R163.2 R617.2 ; off-sheet MCU_HD4_I2C2_SDA
MCU_HD4_I2C_EN: R168.1 U16.5(EN) ; off-sheet MCU_HD4_I2C_EN
NetR106_1: R106.1 U16.2(SCLA)
NetR617_1: R617.1 U16.3(SDAA)

Not connected (* = marked no-connect by the designer): U15 23(NC) 24(NC) 25(NC) 26(NC)

### Layout directives
net class HD: HD4_CH11+, HD4_CH11-, HD4_CH12+, HD4_CH12-, HD4_CH21+, HD4_CH21-, HD4_CH22+, HD4_CH22-, HD4_CH31+, HD4_CH31-, HD4_CH32+, HD4_CH32-, HD4_CH41+, HD4_CH41-, HD4_CH42+, HD4_CH42-

### Notes on the sheet
- Project:
- Sub-system:
- Design by:
- Sheet title:
- Sheet
- of
- Checked by:
- Approved by:
- Revision:
- Document No:
- Size:
- Date:
- A3

### Library data of the parts
C107-C110 = _CAP_C_2: CAP CHIP
J9 J10 = Header 8x1_2M
R106 R158-R165 R168 R617 = _RES_B_2: RES
U15 = mp_HighDriver4

## Sheet 15_SOLEDNOID.SchDoc
size 420 x 297 mm; SheetNumber: 23; SheetTotal: 28
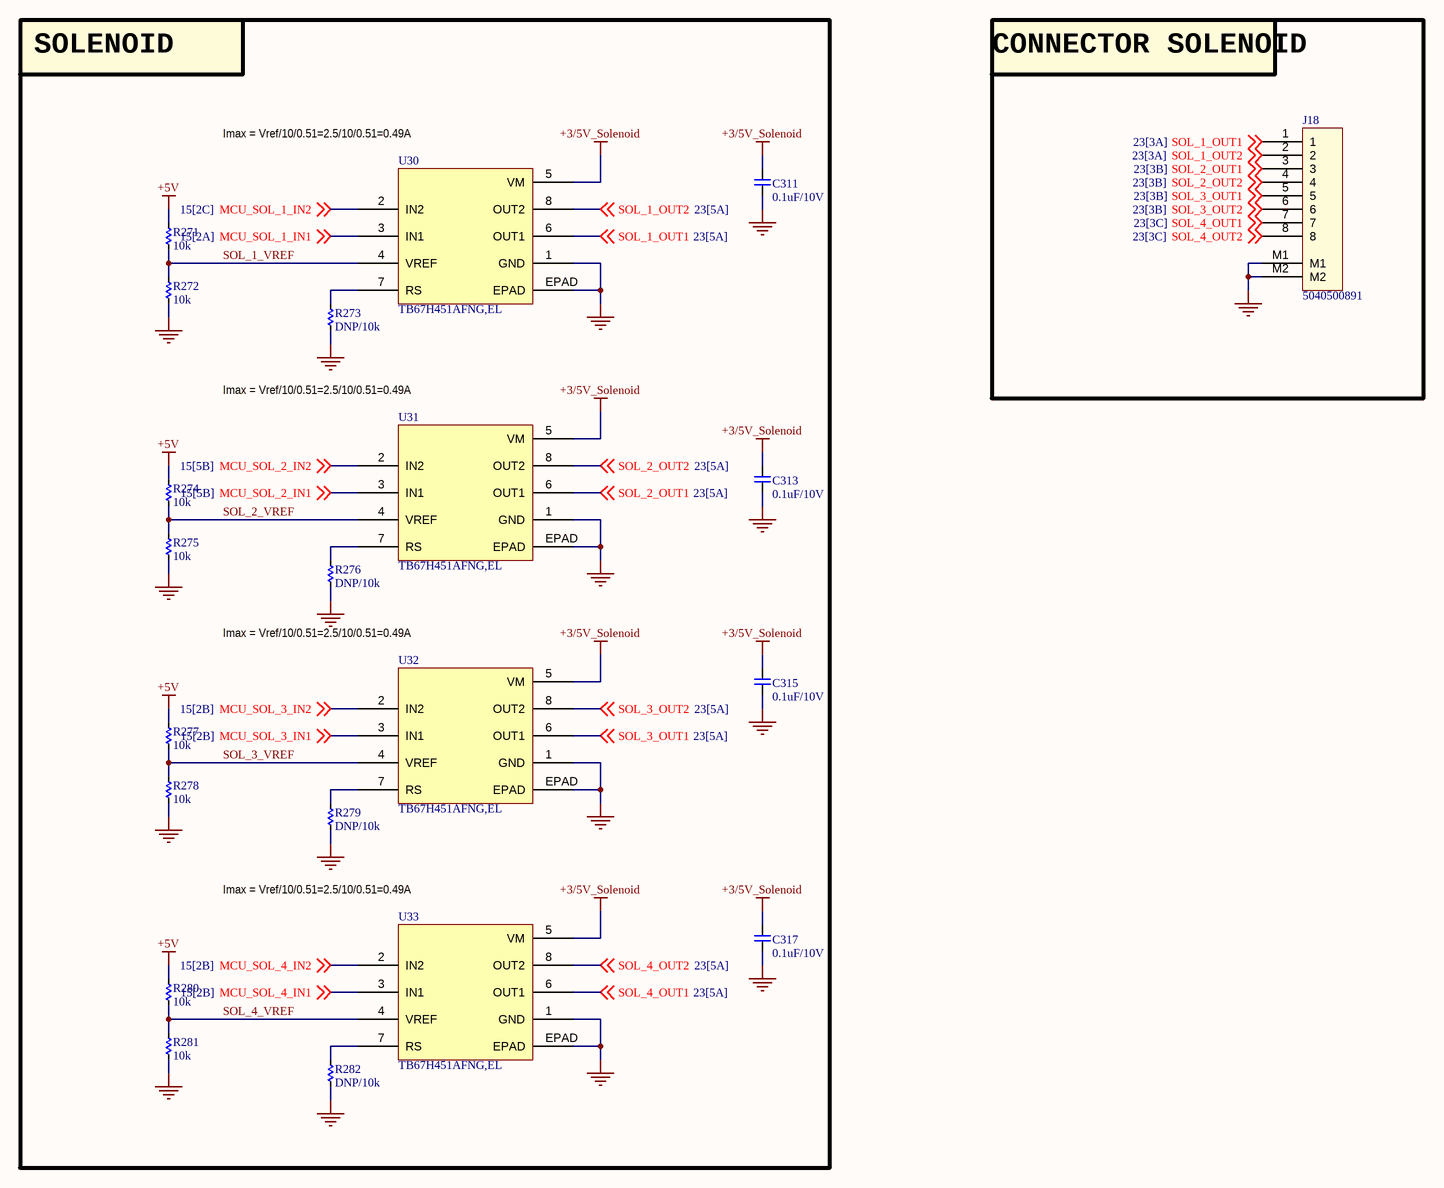
[diagram p24: 15_SOLEDNOID.SchDoc]

### Parts
C311  0.1uF/10V  [CAP_C_1005X60]
C313  0.1uF/10V  [CAP_C_1005X60]
C315  0.1uF/10V  [CAP_C_1005X60]
C317  0.1uF/10V  [CAP_C_1005X60]
J18  5040500891  [MOLEX_5040500891]
R271  10k  [RES_C_1005X40]
R272  10k  [RES_C_1005X40]
R273  DNP/10k  [RES_C_1005X40]
R274  10k  [RES_C_1005X40]
R275  10k  [RES_C_1005X40]
R276  DNP/10k  [RES_C_1005X40]
R277  10k  [RES_C_1005X40]
R278  10k  [RES_C_1005X40]
R279  DNP/10k  [RES_C_1005X40]
R280  10k  [RES_C_1005X40]
R281  10k  [RES_C_1005X40]
R282  DNP/10k  [RES_C_1005X40]
U30  TB67H451AFNG,EL  [SOIC127P602X173-8N_EPAD]
U31  TB67H451AFNG,EL  [SOIC127P602X173-8N_EPAD]
U32  TB67H451AFNG,EL  [SOIC127P602X173-8N_EPAD]
U33  TB67H451AFNG,EL  [SOIC127P602X173-8N_EPAD]

### Blocks framed on the sheet
SOLENOID: C311 C313 C315 C317 R271-R282 U30-U33
CONNECTOR SOLENOID: J18

### Nets
+3/5V_Solenoid: C311.2 C313.2 C315.2 C317.2 U30.5(VM) U31.5(VM) U32.5(VM) U33.5(VM)
+5V: R271.1 R274.1 R277.1 R280.1
GND: C311.1 C313.1 C315.1 C317.1 J18.M1 J18.M2 R272.2 R273.2 R275.2 R276.2 R278.2 R279.2 R281.2 R282.2 U30.1(GND) U30.EPAD U31.1(GND) U31.EPAD U32.1(GND) U32.EPAD U33.1(GND) U33.EPAD
MCU_SOL_1_IN1: U30.3(IN1) ; off-sheet MCU_SOL_1_IN1
MCU_SOL_1_IN2: U30.2(IN2) ; off-sheet MCU_SOL_1_IN2
MCU_SOL_2_IN1: U31.3(IN1) ; off-sheet MCU_SOL_2_IN1
MCU_SOL_2_IN2: U31.2(IN2) ; off-sheet MCU_SOL_2_IN2
MCU_SOL_3_IN1: U32.3(IN1) ; off-sheet MCU_SOL_3_IN1
MCU_SOL_3_IN2: U32.2(IN2) ; off-sheet MCU_SOL_3_IN2
MCU_SOL_4_IN1: U33.3(IN1) ; off-sheet MCU_SOL_4_IN1
MCU_SOL_4_IN2: U33.2(IN2) ; off-sheet MCU_SOL_4_IN2
SOL_1_OUT1: J18.1 U30.6(OUT1) ; off-sheet SOL_1_OUT1
SOL_1_OUT2: J18.2 U30.8(OUT2) ; off-sheet SOL_1_OUT2
SOL_1_VREF: R271.2 R272.1 U30.4(VREF)
SOL_2_OUT1: J18.3 U31.6(OUT1) ; off-sheet SOL_2_OUT1
SOL_2_OUT2: J18.4 U31.8(OUT2) ; off-sheet SOL_2_OUT2
SOL_2_VREF: R274.2 R275.1 U31.4(VREF)
SOL_3_OUT1: J18.5 U32.6(OUT1) ; off-sheet SOL_3_OUT1
SOL_3_OUT2: J18.6 U32.8(OUT2) ; off-sheet SOL_3_OUT2
SOL_3_VREF: R277.2 R278.1 U32.4(VREF)
SOL_4_OUT1: J18.7 U33.6(OUT1) ; off-sheet SOL_4_OUT1
SOL_4_OUT2: J18.8 U33.8(OUT2) ; off-sheet SOL_4_OUT2
SOL_4_VREF: R280.2 R281.1 U33.4(VREF)
NetR273_1: R273.1 U30.7(RS)
NetR276_1: R276.1 U31.7(RS)
NetR279_1: R279.1 U32.7(RS)
NetR282_1: R282.1 U33.7(RS)

### Notes on the sheet
- (near U30) Imax = Vref/10/0.51=2.5/10/0.51=0.49A
- Imax = Vref/10/0.51=2.5/10/0.51=0.49A
- Project:
- Sub-system:
- Design by:
- Sheet title:
- Sheet
- of
- Checked by:
- Approved by:
- Revision:
- Document No:
- Size:
- Date:
- A3

### Library data of the parts
C311 C313 C315 C317 = _CAP_C_2: CAP CHIP
J18 = Header 8x1_2M
R271-R282 = _RES_B_2: RES
U30-U33 = IC_H_bridge_TB67H451AFNG,EL: BRUSHED MOTOR DRIVER IC, 50V, 3.